# Altium project Wolf-Lite.PrjPcb (part 1 of 2)
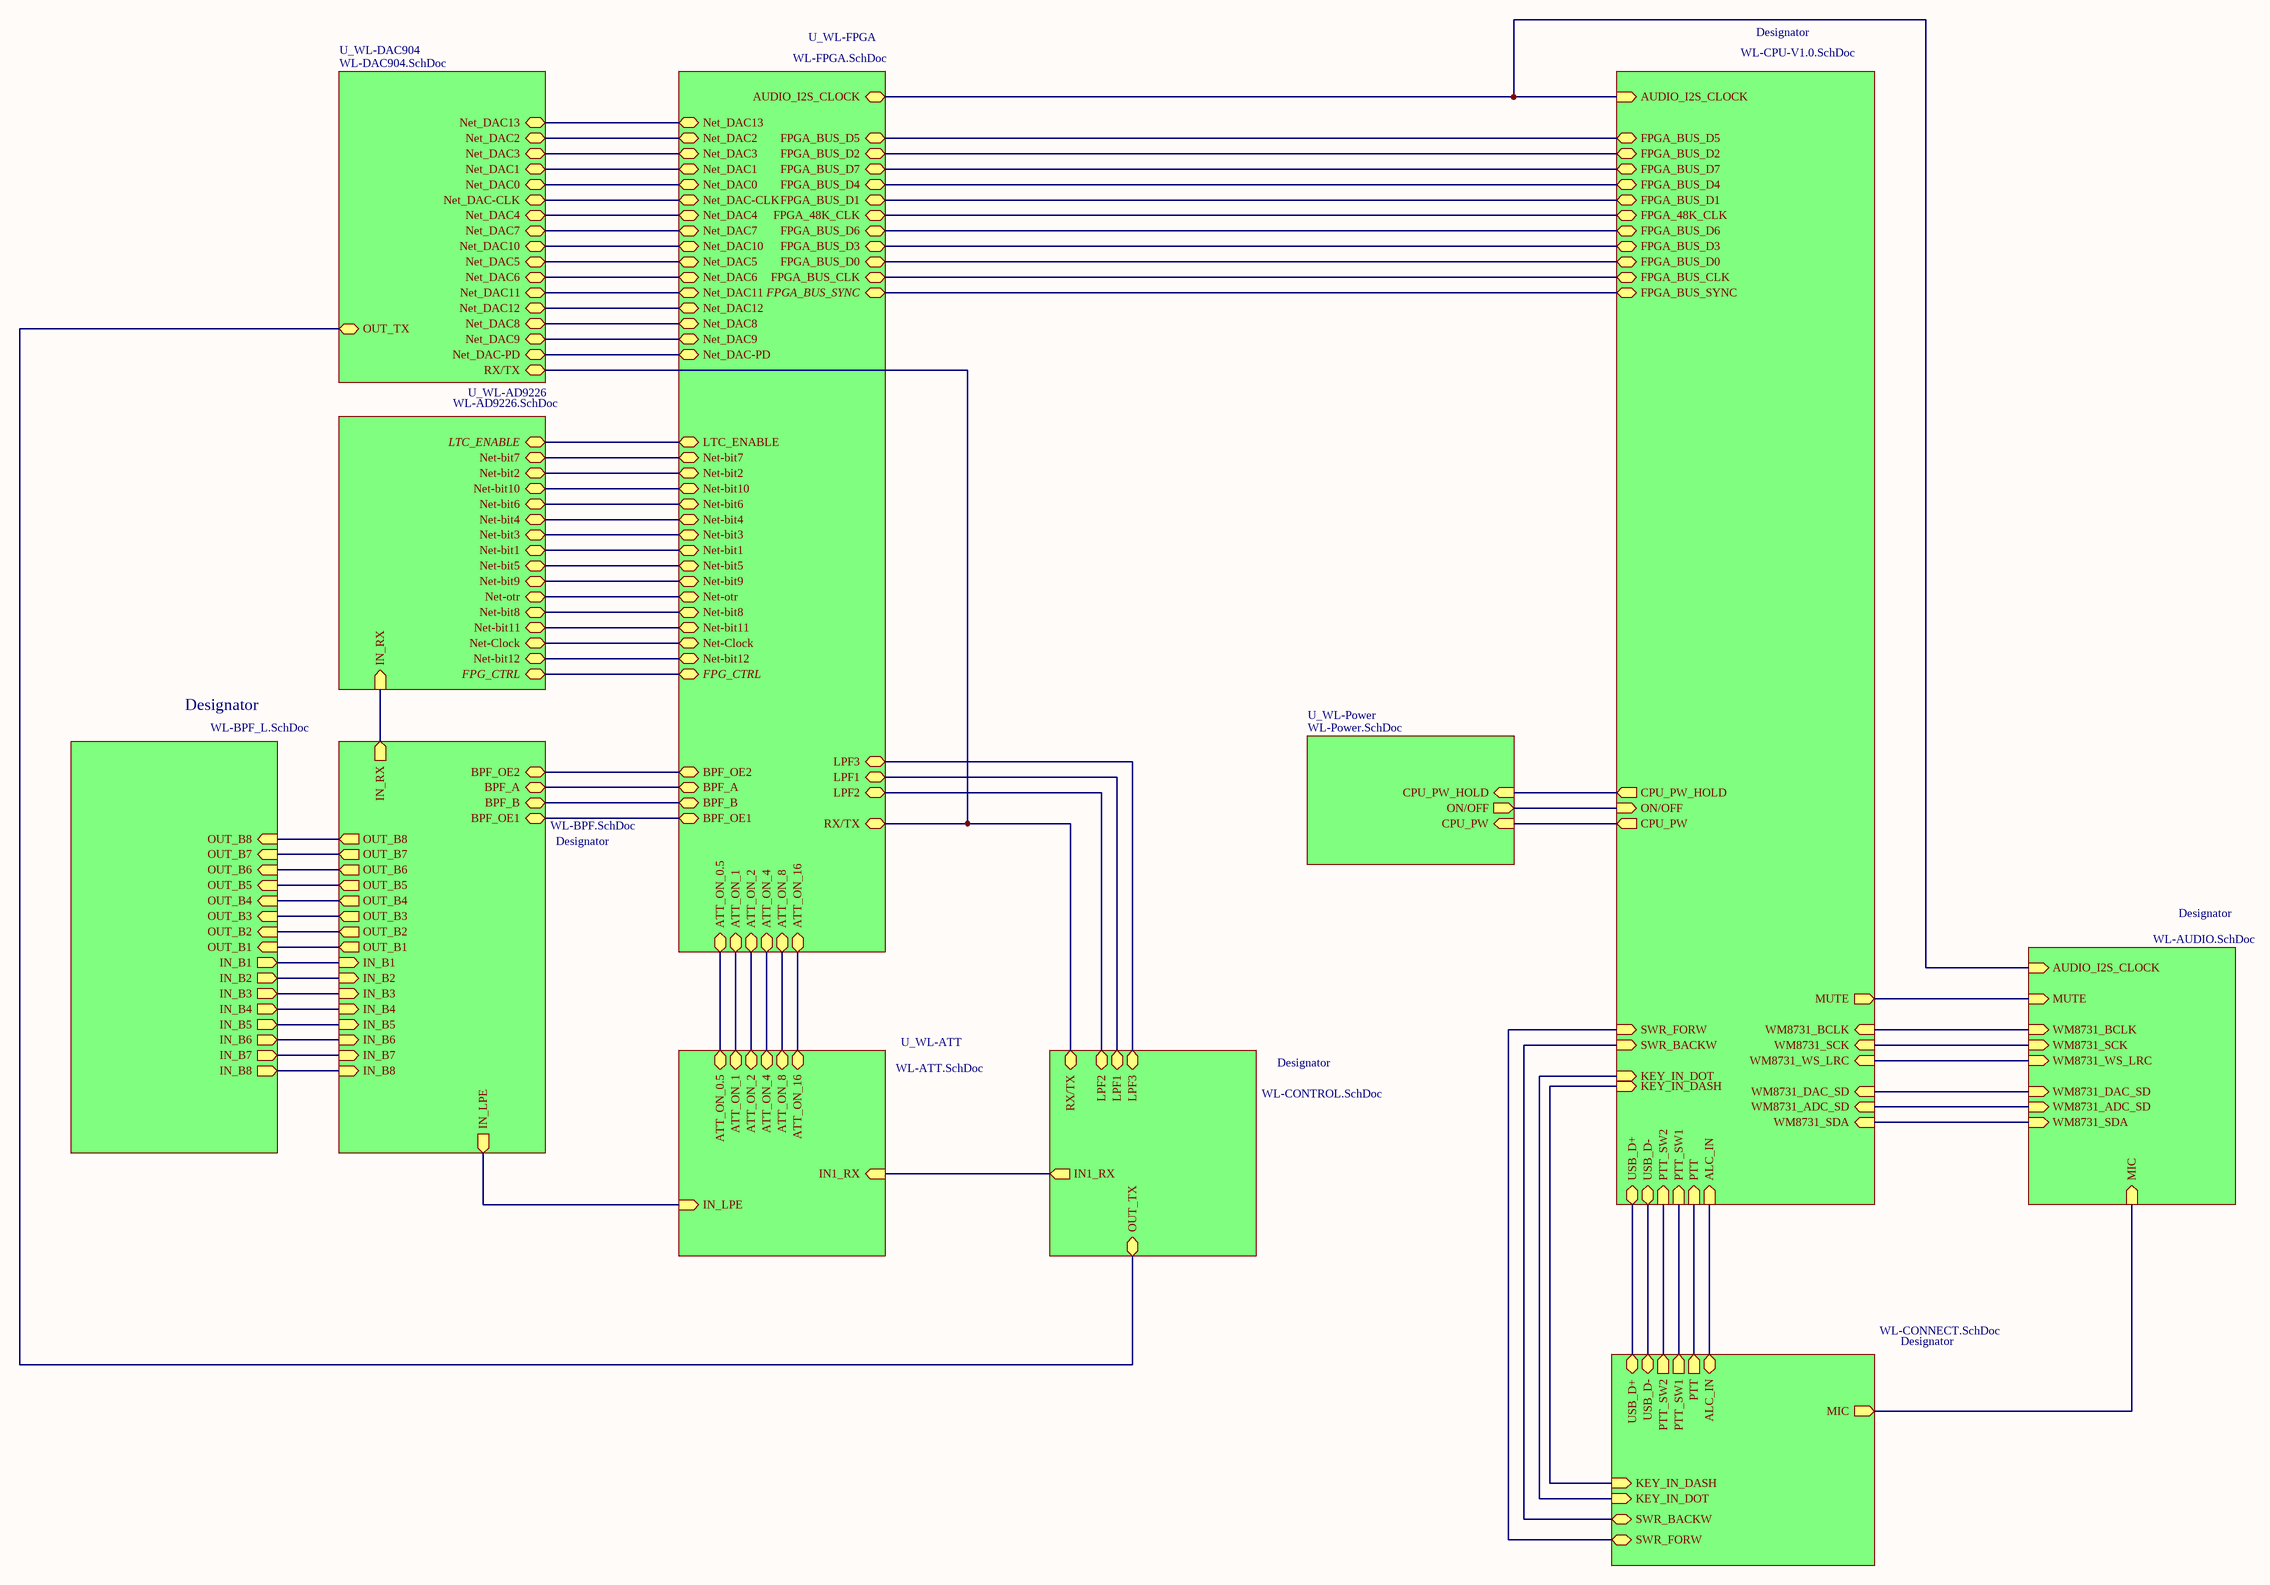
[diagram p0: WL-STUKTURNAY.SchDoc]
12 sheets, 403 parts. Net scope: hierarchical (ports join the sheet entries above them; power ports are global).
Board file: WL-MAIN.PcbDoc
Sheets:
  WL-STUKTURNAY.SchDoc
    U_WL-Power = WL-Power.SchDoc
    U_WL-AD9226 = WL-AD9226.SchDoc
    U_WL-FPGA = WL-FPGA.SchDoc
    U_WL-DAC904 = WL-DAC904.SchDoc
    U_WL-ATT = WL-ATT.SchDoc
    Designator = WL-CPU-V1.0.SchDoc
    Designator = WL-AUDIO.SchDoc
    Designator = WL-CONTROL.SchDoc
    Designator = WL-BPF.SchDoc
    Designator = WL-CONNECT.SchDoc
    Designator = WL-BPF_L.SchDoc

## Sheet WL-STUKTURNAY.SchDoc: WOLF-LITE
size 594 x 420 mm; Author: UA3REO/R7KBI; Address1: Address1; Address2: Address2; Address3: Address3; Address4: Address4; DocumentNumber: Wolf-Lite; SheetNumber: 1; SheetTotal: 12; Scale: 1:1; DocumentType: Схема электрическая принципиальная; FirstReferrence: АБВГ.123456.001

### Sub-sheets
Designator = WL-CPU-V1.0.SchDoc: MUTE (out), USB_D+ (bidir), USB_D- (bidir), PTT_SW2 (in), PTT_SW1 (in), PTT (in), FPGA_BUS_D5 (bidir), FPGA_BUS_D2 (bidir), FPGA_BUS_D7 (bidir), FPGA_BUS_D4 (bidir), FPGA_BUS_D1 (bidir), FPGA_48K_CLK (bidir), FPGA_BUS_D6 (bidir), FPGA_BUS_D3 (bidir), FPGA_BUS_D0 (bidir), FPGA_BUS_CLK (bidir), FPGA_BUS_SYNC (bidir), CPU_PW_HOLD (out), ON/OFF (in), CPU_PW (out), KEY_IN_DOT (in), KEY_IN_DASH (in), SWR_FORW (in), SWR_BACKW (in), ALC_IN (in), AUDIO_I2S_CLOCK (in), WM8731_SCK (in), WM8731_BCLK (in), WM8731_WS_LRC (in), WM8731_DAC_SD (in), WM8731_ADC_SD (in), WM8731_SDA (in)
Designator = WL-AUDIO.SchDoc: MUTE (in), MIC (in), WM8731_BCLK (in), WM8731_SCK (in), WM8731_WS_LRC (in), AUDIO_I2S_CLOCK (in), WM8731_DAC_SD (in), WM8731_ADC_SD (in), WM8731_SDA (in)
Designator = WL-CONTROL.SchDoc: OUT_TX (bidir), LPF2 (bidir), LPF1 (bidir), LPF3 (bidir), IN1_RX (out), RX/TX (bidir)
Designator = WL-BPF.SchDoc: IN_RX (out), BPF_OE2 (bidir), BPF_A (bidir), BPF_B (bidir), BPF_OE1 (bidir), OUT_B8 (out), OUT_B7 (out), OUT_B6 (out), OUT_B5 (out), OUT_B4 (out), OUT_B3 (out), OUT_B2 (out), OUT_B1 (out), IN_B1 (in), IN_B2 (in), IN_B3 (in), IN_B4 (in), IN_B5 (in), IN_B6 (in), IN_B7 (in), IN_B8 (in), IN_LPE (out)
Designator = WL-CONNECT.SchDoc: USB_D- (bidir), PTT (out), MIC (out), USB_D+ (bidir), PTT_SW2 (out), PTT_SW1 (out), ALC_IN (bidir), KEY_IN_DASH (in), KEY_IN_DOT (in), SWR_FORW (bidir), SWR_BACKW (bidir)
Designator = WL-BPF_L.SchDoc: OUT_B2 (in), OUT_B3 (in), OUT_B4 (in), OUT_B1 (in), IN_B1 (out), IN_B2 (out), IN_B3 (out), IN_B4 (out), OUT_B7 (in), OUT_B6 (in), OUT_B5 (in), IN_B7 (out), IN_B6 (out), IN_B5 (out), IN_B8 (out), OUT_B8 (in)
U_WL-AD9226 = WL-AD9226.SchDoc: Net-bit7 (bidir), Net-bit2 (bidir), Net-bit10 (bidir), Net-bit6 (bidir), Net-bit4 (bidir), Net-bit3 (bidir), Net-bit1 (bidir), Net-bit5 (bidir), Net-bit9 (bidir), Net-otr (bidir), Net-bit8 (bidir), Net-bit11 (bidir), Net-Clock (bidir), Net-bit12 (bidir), LTC_ENABLE (bidir), IN_RX (in), FPG_CTRL (bidir)
U_WL-ATT = WL-ATT.SchDoc: ATT_ON_1 (bidir), ATT_ON_2 (bidir), ATT_ON_16 (bidir), ATT_ON_8 (bidir), ATT_ON_4 (bidir), ATT_ON_0.5 (bidir), IN_LPE (in), IN1_RX (in)
U_WL-DAC904 = WL-DAC904.SchDoc: Net_DAC13 (bidir), Net_DAC2 (bidir), Net_DAC3 (bidir), Net_DAC1 (bidir), Net_DAC0 (bidir), Net_DAC-CLK (bidir), Net_DAC4 (bidir), Net_DAC7 (bidir), Net_DAC10 (bidir), Net_DAC5 (bidir), Net_DAC6 (bidir), Net_DAC11 (bidir), Net_DAC12 (bidir), Net_DAC8 (bidir), Net_DAC9 (bidir), OUT_TX (bidir), Net_DAC-PD (bidir), RX/TX (bidir)
U_WL-FPGA = WL-FPGA.SchDoc: FPGA_BUS_D5 (bidir), FPGA_BUS_D2 (bidir), FPGA_BUS_D7 (bidir), AUDIO_I2S_CLOCK (bidir), FPGA_BUS_D4 (bidir), FPGA_BUS_D1 (bidir), FPGA_48K_CLK (bidir), FPGA_BUS_D6 (bidir), FPGA_BUS_D3 (bidir), FPGA_BUS_D0 (bidir), FPGA_BUS_CLK (bidir), FPGA_BUS_SYNC (bidir), ATT_ON_0.5 (bidir), ATT_ON_1 (bidir), ATT_ON_2 (bidir), ATT_ON_4 (bidir), ATT_ON_8 (bidir), ATT_ON_16 (bidir), Net_DAC13 (bidir), Net_DAC2 (bidir), Net_DAC3 (bidir), Net_DAC1 (bidir), Net_DAC0 (bidir), Net_DAC-CLK (bidir), Net_DAC4 (bidir), Net_DAC7 (bidir), Net_DAC10 (bidir), Net_DAC5 (bidir), Net_DAC6 (bidir), Net_DAC11 (bidir), Net_DAC12 (bidir), Net_DAC8 (bidir), Net_DAC9 (bidir), Net-bit7 (bidir), Net-bit2 (bidir), Net-bit10 (bidir), Net-bit6 (bidir), Net-bit4 (bidir), Net-bit3 (bidir), Net-bit1 (bidir), Net-bit5 (bidir), Net-bit9 (bidir), Net-otr (bidir), Net-bit8 (bidir), Net-bit11 (bidir), Net-Clock (bidir), Net-bit12 (bidir), BPF_OE2 (bidir), BPF_A (bidir), BPF_B (bidir), BPF_OE1 (bidir), LPF2 (bidir), LPF1 (bidir), LPF3 (bidir), Net_DAC-PD (bidir), RX/TX (bidir), LTC_ENABLE (bidir), FPG_CTRL (bidir)
U_WL-Power = WL-Power.SchDoc: CPU_PW_HOLD (in), ON/OFF (out), CPU_PW (in)

### Nets
ALC_IN: sheet Designator/ALC_IN, sheet Designator/ALC_IN
ATT_ON_0.5: sheet U_WL-FPGA/ATT_ON_0.5, sheet U_WL-ATT/ATT_ON_0.5
ATT_ON_1: sheet U_WL-FPGA/ATT_ON_1, sheet U_WL-ATT/ATT_ON_1
ATT_ON_2: sheet U_WL-FPGA/ATT_ON_2, sheet U_WL-ATT/ATT_ON_2
ATT_ON_4: sheet U_WL-FPGA/ATT_ON_4, sheet U_WL-ATT/ATT_ON_4
ATT_ON_8: sheet U_WL-FPGA/ATT_ON_8, sheet U_WL-ATT/ATT_ON_8
ATT_ON_16: sheet U_WL-FPGA/ATT_ON_16, sheet U_WL-ATT/ATT_ON_16
AUDIO_I2S_CLOCK: sheet U_WL-FPGA/AUDIO_I2S_CLOCK, sheet Designator/AUDIO_I2S_CLOCK, sheet Designator/AUDIO_I2S_CLOCK
BPF_A: sheet U_WL-FPGA/BPF_A, sheet Designator/BPF_A
BPF_B: sheet U_WL-FPGA/BPF_B, sheet Designator/BPF_B
BPF_OE1: sheet U_WL-FPGA/BPF_OE1, sheet Designator/BPF_OE1
BPF_OE2: sheet U_WL-FPGA/BPF_OE2, sheet Designator/BPF_OE2
CPU_PW: sheet U_WL-Power/CPU_PW, sheet Designator/CPU_PW
CPU_PW_HOLD: sheet U_WL-Power/CPU_PW_HOLD, sheet Designator/CPU_PW_HOLD
FPG_CTRL: sheet U_WL-AD9226/FPG_CTRL, sheet U_WL-FPGA/FPG_CTRL
FPGA_48K_CLK: sheet U_WL-FPGA/FPGA_48K_CLK, sheet Designator/FPGA_48K_CLK
FPGA_BUS_CLK: sheet U_WL-FPGA/FPGA_BUS_CLK, sheet Designator/FPGA_BUS_CLK
FPGA_BUS_D0: sheet U_WL-FPGA/FPGA_BUS_D0, sheet Designator/FPGA_BUS_D0
FPGA_BUS_D1: sheet U_WL-FPGA/FPGA_BUS_D1, sheet Designator/FPGA_BUS_D1
FPGA_BUS_D2: sheet U_WL-FPGA/FPGA_BUS_D2, sheet Designator/FPGA_BUS_D2
FPGA_BUS_D3: sheet U_WL-FPGA/FPGA_BUS_D3, sheet Designator/FPGA_BUS_D3
FPGA_BUS_D4: sheet U_WL-FPGA/FPGA_BUS_D4, sheet Designator/FPGA_BUS_D4
FPGA_BUS_D5: sheet U_WL-FPGA/FPGA_BUS_D5, sheet Designator/FPGA_BUS_D5
FPGA_BUS_D6: sheet U_WL-FPGA/FPGA_BUS_D6, sheet Designator/FPGA_BUS_D6
FPGA_BUS_D7: sheet U_WL-FPGA/FPGA_BUS_D7, sheet Designator/FPGA_BUS_D7
FPGA_BUS_SYNC: sheet U_WL-FPGA/FPGA_BUS_SYNC, sheet Designator/FPGA_BUS_SYNC
IN_B1: sheet Designator/IN_B1, sheet Designator/IN_B1
IN_B2: sheet Designator/IN_B2, sheet Designator/IN_B2
IN_B3: sheet Designator/IN_B3, sheet Designator/IN_B3
IN_B4: sheet Designator/IN_B4, sheet Designator/IN_B4
IN_B5: sheet Designator/IN_B5, sheet Designator/IN_B5
IN_B6: sheet Designator/IN_B6, sheet Designator/IN_B6
IN_B7: sheet Designator/IN_B7, sheet Designator/IN_B7
IN_B8: sheet Designator/IN_B8, sheet Designator/IN_B8
IN_LPE: sheet U_WL-ATT/IN_LPE, sheet Designator/IN_LPE
IN_RX: sheet U_WL-AD9226/IN_RX, sheet Designator/IN_RX
KEY_IN_DASH: sheet Designator/KEY_IN_DASH, sheet Designator/KEY_IN_DASH
KEY_IN_DOT: sheet Designator/KEY_IN_DOT, sheet Designator/KEY_IN_DOT
LPF1: sheet U_WL-FPGA/LPF1, sheet Designator/LPF1
LPF2: sheet U_WL-FPGA/LPF2, sheet Designator/LPF2
LPF3: sheet U_WL-FPGA/LPF3, sheet Designator/LPF3
LTC_ENABLE: sheet U_WL-AD9226/LTC_ENABLE, sheet U_WL-FPGA/LTC_ENABLE
MIC: sheet Designator/MIC, sheet Designator/MIC
Net-bit1: sheet U_WL-AD9226/Net-bit1, sheet U_WL-FPGA/Net-bit1
Net-bit2: sheet U_WL-AD9226/Net-bit2, sheet U_WL-FPGA/Net-bit2
Net-bit3: sheet U_WL-AD9226/Net-bit3, sheet U_WL-FPGA/Net-bit3
Net-bit4: sheet U_WL-AD9226/Net-bit4, sheet U_WL-FPGA/Net-bit4
Net-bit5: sheet U_WL-AD9226/Net-bit5, sheet U_WL-FPGA/Net-bit5
Net-bit6: sheet U_WL-AD9226/Net-bit6, sheet U_WL-FPGA/Net-bit6
Net-bit7: sheet U_WL-AD9226/Net-bit7, sheet U_WL-FPGA/Net-bit7
Net-bit8: sheet U_WL-AD9226/Net-bit8, sheet U_WL-FPGA/Net-bit8
Net-bit9: sheet U_WL-AD9226/Net-bit9, sheet U_WL-FPGA/Net-bit9
Net-bit10: sheet U_WL-AD9226/Net-bit10, sheet U_WL-FPGA/Net-bit10
Net-bit11: sheet U_WL-AD9226/Net-bit11, sheet U_WL-FPGA/Net-bit11
Net-bit12: sheet U_WL-AD9226/Net-bit12, sheet U_WL-FPGA/Net-bit12
Net-Clock: sheet U_WL-AD9226/Net-Clock, sheet U_WL-FPGA/Net-Clock
Net-otr: sheet U_WL-AD9226/Net-otr, sheet U_WL-FPGA/Net-otr
Net_DAC0: sheet U_WL-FPGA/Net_DAC0, sheet U_WL-DAC904/Net_DAC0
Net_DAC1: sheet U_WL-FPGA/Net_DAC1, sheet U_WL-DAC904/Net_DAC1
Net_DAC2: sheet U_WL-FPGA/Net_DAC2, sheet U_WL-DAC904/Net_DAC2
Net_DAC3: sheet U_WL-FPGA/Net_DAC3, sheet U_WL-DAC904/Net_DAC3
Net_DAC4: sheet U_WL-FPGA/Net_DAC4, sheet U_WL-DAC904/Net_DAC4
Net_DAC5: sheet U_WL-FPGA/Net_DAC5, sheet U_WL-DAC904/Net_DAC5
Net_DAC6: sheet U_WL-FPGA/Net_DAC6, sheet U_WL-DAC904/Net_DAC6
Net_DAC7: sheet U_WL-FPGA/Net_DAC7, sheet U_WL-DAC904/Net_DAC7
Net_DAC8: sheet U_WL-FPGA/Net_DAC8, sheet U_WL-DAC904/Net_DAC8
Net_DAC9: sheet U_WL-FPGA/Net_DAC9, sheet U_WL-DAC904/Net_DAC9
Net_DAC10: sheet U_WL-FPGA/Net_DAC10, sheet U_WL-DAC904/Net_DAC10
Net_DAC11: sheet U_WL-FPGA/Net_DAC11, sheet U_WL-DAC904/Net_DAC11
Net_DAC12: sheet U_WL-FPGA/Net_DAC12, sheet U_WL-DAC904/Net_DAC12
Net_DAC13: sheet U_WL-FPGA/Net_DAC13, sheet U_WL-DAC904/Net_DAC13
Net_DAC-CLK: sheet U_WL-FPGA/Net_DAC-CLK, sheet U_WL-DAC904/Net_DAC-CLK
Net_DAC-PD: sheet U_WL-FPGA/Net_DAC-PD, sheet U_WL-DAC904/Net_DAC-PD
OUT_B1: sheet Designator/OUT_B1, sheet Designator/OUT_B1
OUT_B2: sheet Designator/OUT_B2, sheet Designator/OUT_B2
OUT_B3: sheet Designator/OUT_B3, sheet Designator/OUT_B3
OUT_B4: sheet Designator/OUT_B4, sheet Designator/OUT_B4
OUT_B5: sheet Designator/OUT_B5, sheet Designator/OUT_B5
OUT_B6: sheet Designator/OUT_B6, sheet Designator/OUT_B6
OUT_B7: sheet Designator/OUT_B7, sheet Designator/OUT_B7
OUT_B8: sheet Designator/OUT_B8, sheet Designator/OUT_B8
PTT: sheet Designator/PTT, sheet Designator/PTT
PTT_SW1: sheet Designator/PTT_SW1, sheet Designator/PTT_SW1
PTT_SW2: sheet Designator/PTT_SW2, sheet Designator/PTT_SW2
RX/TX: sheet U_WL-FPGA/RX/TX, sheet U_WL-DAC904/RX/TX, sheet Designator/RX/TX
SWR_BACKW: sheet Designator/SWR_BACKW, sheet Designator/SWR_BACKW
SWR_FORW: sheet Designator/SWR_FORW, sheet Designator/SWR_FORW
USB_D+: sheet Designator/USB_D+, sheet Designator/USB_D+
USB_D-: sheet Designator/USB_D-, sheet Designator/USB_D-
WM8731_ADC_SD: sheet Designator/WM8731_ADC_SD, sheet Designator/WM8731_ADC_SD
WM8731_BCLK: sheet Designator/WM8731_BCLK, sheet Designator/WM8731_BCLK
WM8731_DAC_SD: sheet Designator/WM8731_DAC_SD, sheet Designator/WM8731_DAC_SD
WM8731_SCK: sheet Designator/WM8731_SCK, sheet Designator/WM8731_SCK
WM8731_SDA: sheet Designator/WM8731_SDA, sheet Designator/WM8731_SDA
WM8731_WS_LRC: sheet Designator/WM8731_WS_LRC, sheet Designator/WM8731_WS_LRC
NetC76_1: sheet U_WL-ATT/IN1_RX, sheet Designator/IN1_RX
NetK1_4: sheet U_WL-DAC904/OUT_TX, sheet Designator/OUT_TX
NetR52_1: sheet U_WL-Power/ON/OFF, sheet Designator/ON/OFF
NetU1_64: sheet Designator/MUTE, sheet Designator/MUTE

### Notes on the sheet
- Перв. примен.
- Справ. №
- Подп. и дата
- Инв. № дубл.
- Взам. инв. №
- Разраб.
- Изм.
- Лист
- № докум.
- Подп.
- Дата
- Лит.
- Масса
- Масштаб
- Пров.
- Т.контр.
- Листов
- Инв. № подл.
- Утв.
- Н.контр.
- 2.106-A2
- Копировал
- Формат А2

## Sheet WL-Power.SchDoc
size 420 x 297 mm; Address1: Address1; Address2: Address2; Address3: Address3; Address4: Address4; DocumentNumber: Wolf-Lite; SheetNumber: 8; Scale: 1:1; DocumentType: Схема электрическая принципиальная; FirstReferrence: UA3REO/R7KBI
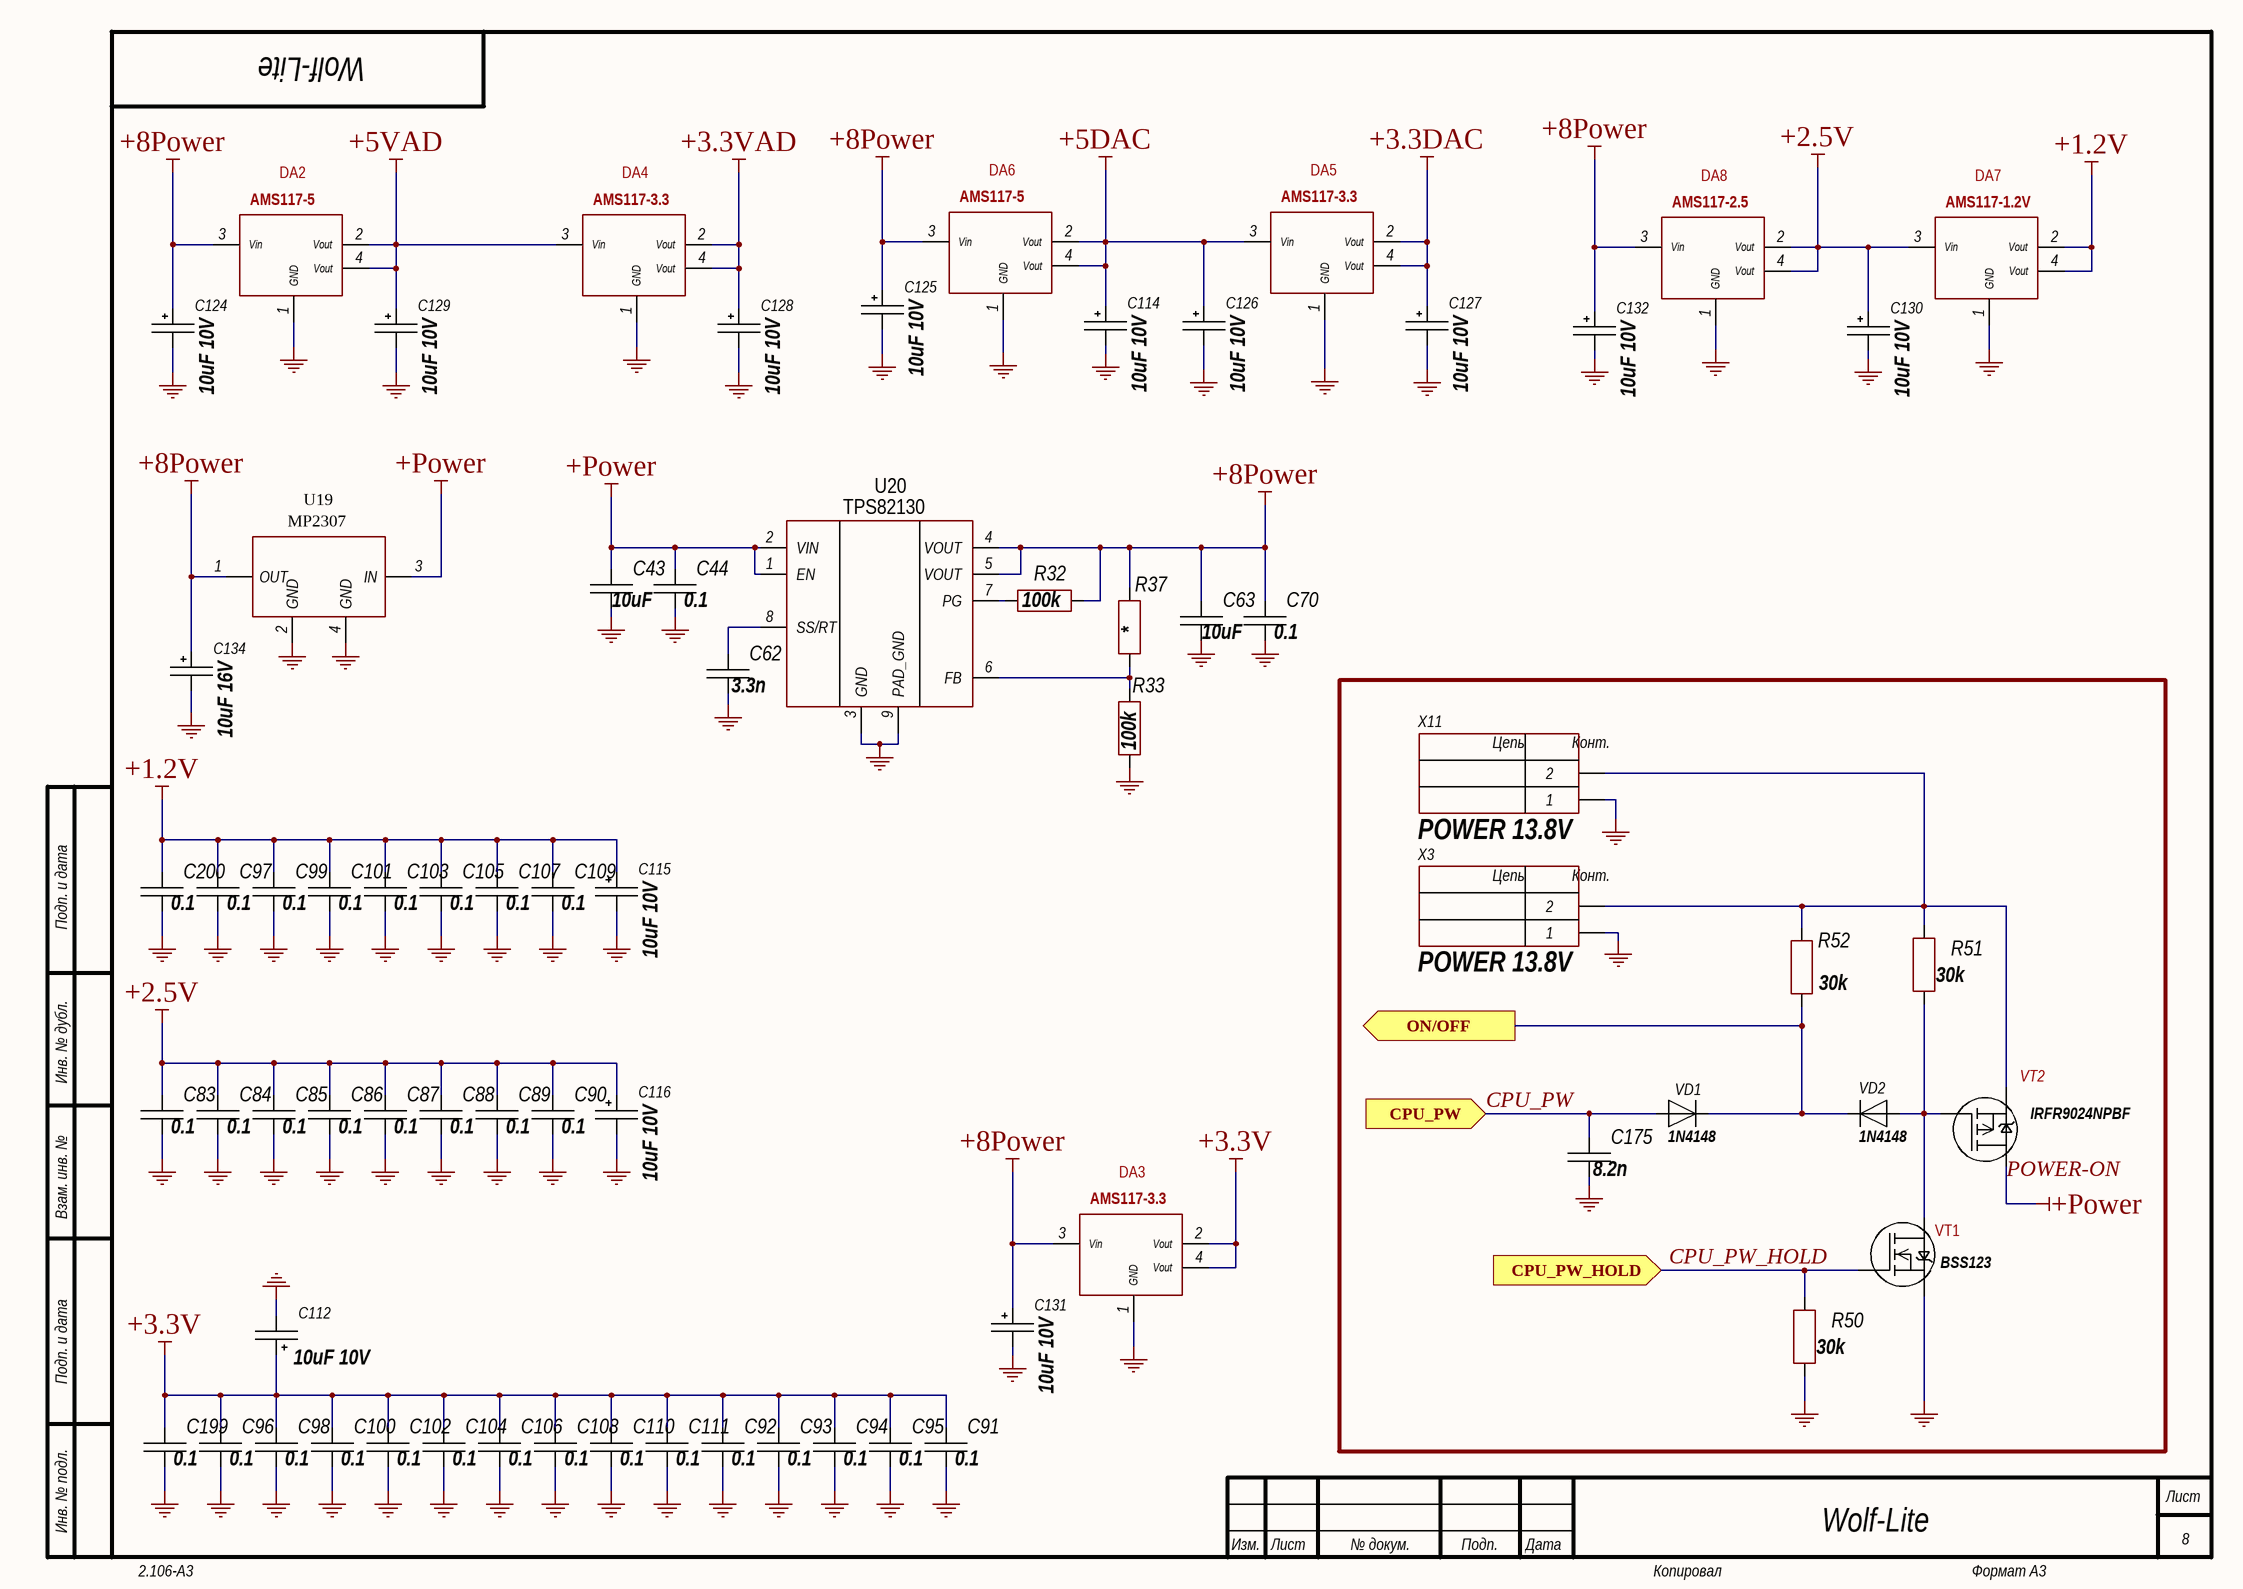
[diagram p1: WL-Power.SchDoc]

### Parts
C43  10uF  [CH1206C]
C44  0.1  [CH0805C]
C62  3.3n  [CH0805C]
C63  10uF  [CH1206C]
C70  0.1  [CH0805C]
C83  0.1  [CH0805C]
C84  0.1  [CH0805C]
C85  0.1  [CH0805C]
C86  0.1  [CH0805C]
C87  0.1  [CH0805C]
C88  0.1  [CH0805C]
C89  0.1  [CH0805C]
C90  0.1  [CH0805C]
C91  0.1  [CH0805C]
C92  0.1  [CH0805C]
C93  0.1  [CH0805C]
C94  0.1  [CH0805C]
C95  0.1  [CH0805C]
C96  0.1  [CH0805C]
C97  0.1  [CH0805C]
C98  0.1  [CH0805C]
C99  0.1  [CH0805C]
C100  0.1  [CH0805C]
C101  0.1  [CH0805C]
C102  0.1  [CH0805C]
C103  0.1  [CH0805C]
C104  0.1  [CH0805C]
C105  0.1  [CH0805C]
C106  0.1  [CH0805C]
C107  0.1  [CH0805C]
C108  0.1  [CH0805C]
C109  0.1  [CH0805C]
C110  0.1  [CH0805C]
C111  0.1  [CH0805C]
C112  10uF 10V  [TANTAL_B]
C114  10uF 10V  [TANTAL_B]
C115  10uF 10V  [TANTAL_B]
C116  10uF 10V  [TANTAL_B]
C124  10uF 10V  [TANTAL_B]
C125  10uF 10V  [TANTAL_B]
C126  10uF 10V  [TANTAL_B]
C127  10uF 10V  [TANTAL_B]
C128  10uF 10V  [TANTAL_B]
C129  10uF 10V  [TANTAL_B]
C130  10uF 10V  [TANTAL_B]
C131  10uF 10V  [TANTAL_B]
C132  10uF 10V  [TANTAL_B]
C134  10uF 16V  [POLIMER-D]
C175  8.2n  [CH0805C]
C199  0.1  [CH0805C]
C200  0.1  [CH0805C]
DA2  AMS117-5  [SOT223]
DA3  AMS117-3.3  [SOT223]
DA4  AMS117-3.3  [SOT223]
DA5  AMS117-3.3  [SOT223]
DA6  AMS117-5  [SOT223]
DA7  AMS117-1.2V  [SOT223]
DA8  AMS117-2.5  [SOT223]
R32  100k  [CH0805R]
R33  100k  [CH0805R]
R37  *  [CH0805R]
R50  30k  [CH0805R]
R51  30k  [CH0805R]
R52  30k  [CH0805R]
U19  MP2307  [MP2307 MINI360]
U20  TPS82130  [TPS82130SILT]
VD1  1N4148  [1N4148]
VD2  1N4148  [1N4148]
VT1  BSS123  [SOT23_132]
VT2  IRFR9024NPBF  [D2PAK_132]
X3  POWER 13.8V  [CON: 300-02P-5.0]
X11  POWER 13.8V  [CON: 300-02P-5.0]

### Ports
CPU_PW (in), CPU_PW_HOLD (in), ON/OFF (out)

### Nets
+1.2V: C97.1 C99.1 C101.1 C103.1 C105.1 C107.1 C109.1 C115.1 C200.1 DA7.2(Vout) DA7.4(Vout)
+2.5V: C83.1 C84.1 C85.1 C86.1 C87.1 C88.1 C89.1 C90.1 C116.1 C130.1 DA7.3(Vin) DA8.2(Vout) DA8.4(Vout)
+3.3DAC: C127.1 DA5.2(Vout) DA5.4(Vout)
+3.3V: C91.1 C92.1 C93.1 C94.1 C95.1 C96.1 C98.1 C100.1 C102.1 C104.1 C106.1 C108.1 C110.1 C111.1 C112.1 C199.1 DA3.2(Vout) DA3.4(Vout)
+3.3VAD: C128.1 DA4.2(Vout) DA4.4(Vout)
+5DAC: C114.1 C126.1 DA5.3(Vin) DA6.2(Vout) DA6.4(Vout)
+5VAD: C129.1 DA2.2(Vout) DA2.4(Vout) DA4.3(Vin)
+8Power: C63.1 C70.1 C124.1 C125.1 C131.1 C132.1 C134.1 DA2.3(Vin) DA3.3(Vin) DA6.3(Vin) DA8.3(Vin) R32.1 R37.1 U19.1(OUT) U20.4(VOUT) U20.5(VOUT)
GND: C43.2 C44.2 C62.2 C63.2 C70.2 C83.2 C84.2 C85.2 C86.2 C87.2 C88.2 C89.2 C90.2 C91.2 C92.2 C93.2 C94.2 C95.2 C96.2 C97.2 C98.2 C99.2 C100.2 C101.2 C102.2 C103.2 C104.2 C105.2 C106.2 C107.2 C108.2 C109.2 C110.2 C111.2 C112.2 C114.2 C115.2 C116.2 C124.2 C125.2 C126.2 C127.2 C128.2 C129.2 C130.2 C131.2 C132.2 C134.2 C175.2 C199.2 C200.2 DA2.1(GND) DA3.1(GND) DA4.1(GND) DA5.1(GND) DA6.1(GND) DA7.1(GND) DA8.1(GND) R33.2 R50.1 U19.2(GND) U19.4(GND) U20.3(GND) U20.9(PAD_GND) VT1.2(I) X3.1 X11.1
POWER-ON: C43.1 C44.1 U19.3(IN) U20.1(EN) U20.2(VIN) VT2.3(D)  [also labelled +Power]
CPU_PW: C175.1 VD1.1 ; port CPU_PW
CPU_PW_HOLD: R50.2 VT1.1(Затвор(Gate)) ; port CPU_PW_HOLD
NetC62_1: C62.1 U20.8(SS/RT)
NetR32_2: R32.2 U20.7(PG)
NetR33_1: R33.1 R37.2 U20.6(FB)
NetR51_1: R51.1 VD2.1 VT1.3(Сток(Drain)) VT2.1(Затвор(Gate))
NetR51_2: R51.2 R52.2 VT2.2(S) X3.2 X11.2
NetR52_1: R52.1 VD1.2 VD2.2 ; port ON/OFF

### Notes on the sheet
- Подп. и дата
- Инв. № дубл.
- Взам. инв. №
- Инв. № подл.
- Изм.
- Лист
- № докум.
- Подп.
- Дата
- 2.106-A3
- Копировал
- Формат А3
- (in symbol 2-Connector) Цепь; Конт.

### Library data of the parts
C43 C44 C62 C63 C70 C83-C111 C175 C199 C200 = Capacitor: Manufacturer: *; Model: *; HelpURL: *; ComponentKind: *; Value: *
C112 C114-C116 C124-C132 C134 = TantalCap: Manufacturer: *; Model: *; HelpURL: *; ComponentKind: *; Value: *
DA2-DA8 = AMS117
R32 R33 R37 R50-R52 = Resistor: Manufacturer: *; Model: *; HelpURL: *; ComponentKind: *; Value: *
VD1 VD2 = Diod: ComponentKind: *; Manufacturer: *; Model: *; HelpURL: *
VT1 = N-KANAL
VT2 = P-KANAL
X3 X11 = 2-Connector: Model: *; Manufacturer: *; HelpURL: *; ComponentKind: *

## Sheet WL-AD9226.SchDoc
size 594 x 420 mm; Address1: Address1; Address2: Address2; Address3: Address3; Address4: Address4; DocumentNumber: Wolf-Lite; SheetNumber: 4; Scale: 1:1; DocumentType: Схема электрическая принципиальная; FirstReferrence: UA3REO/R7KBI
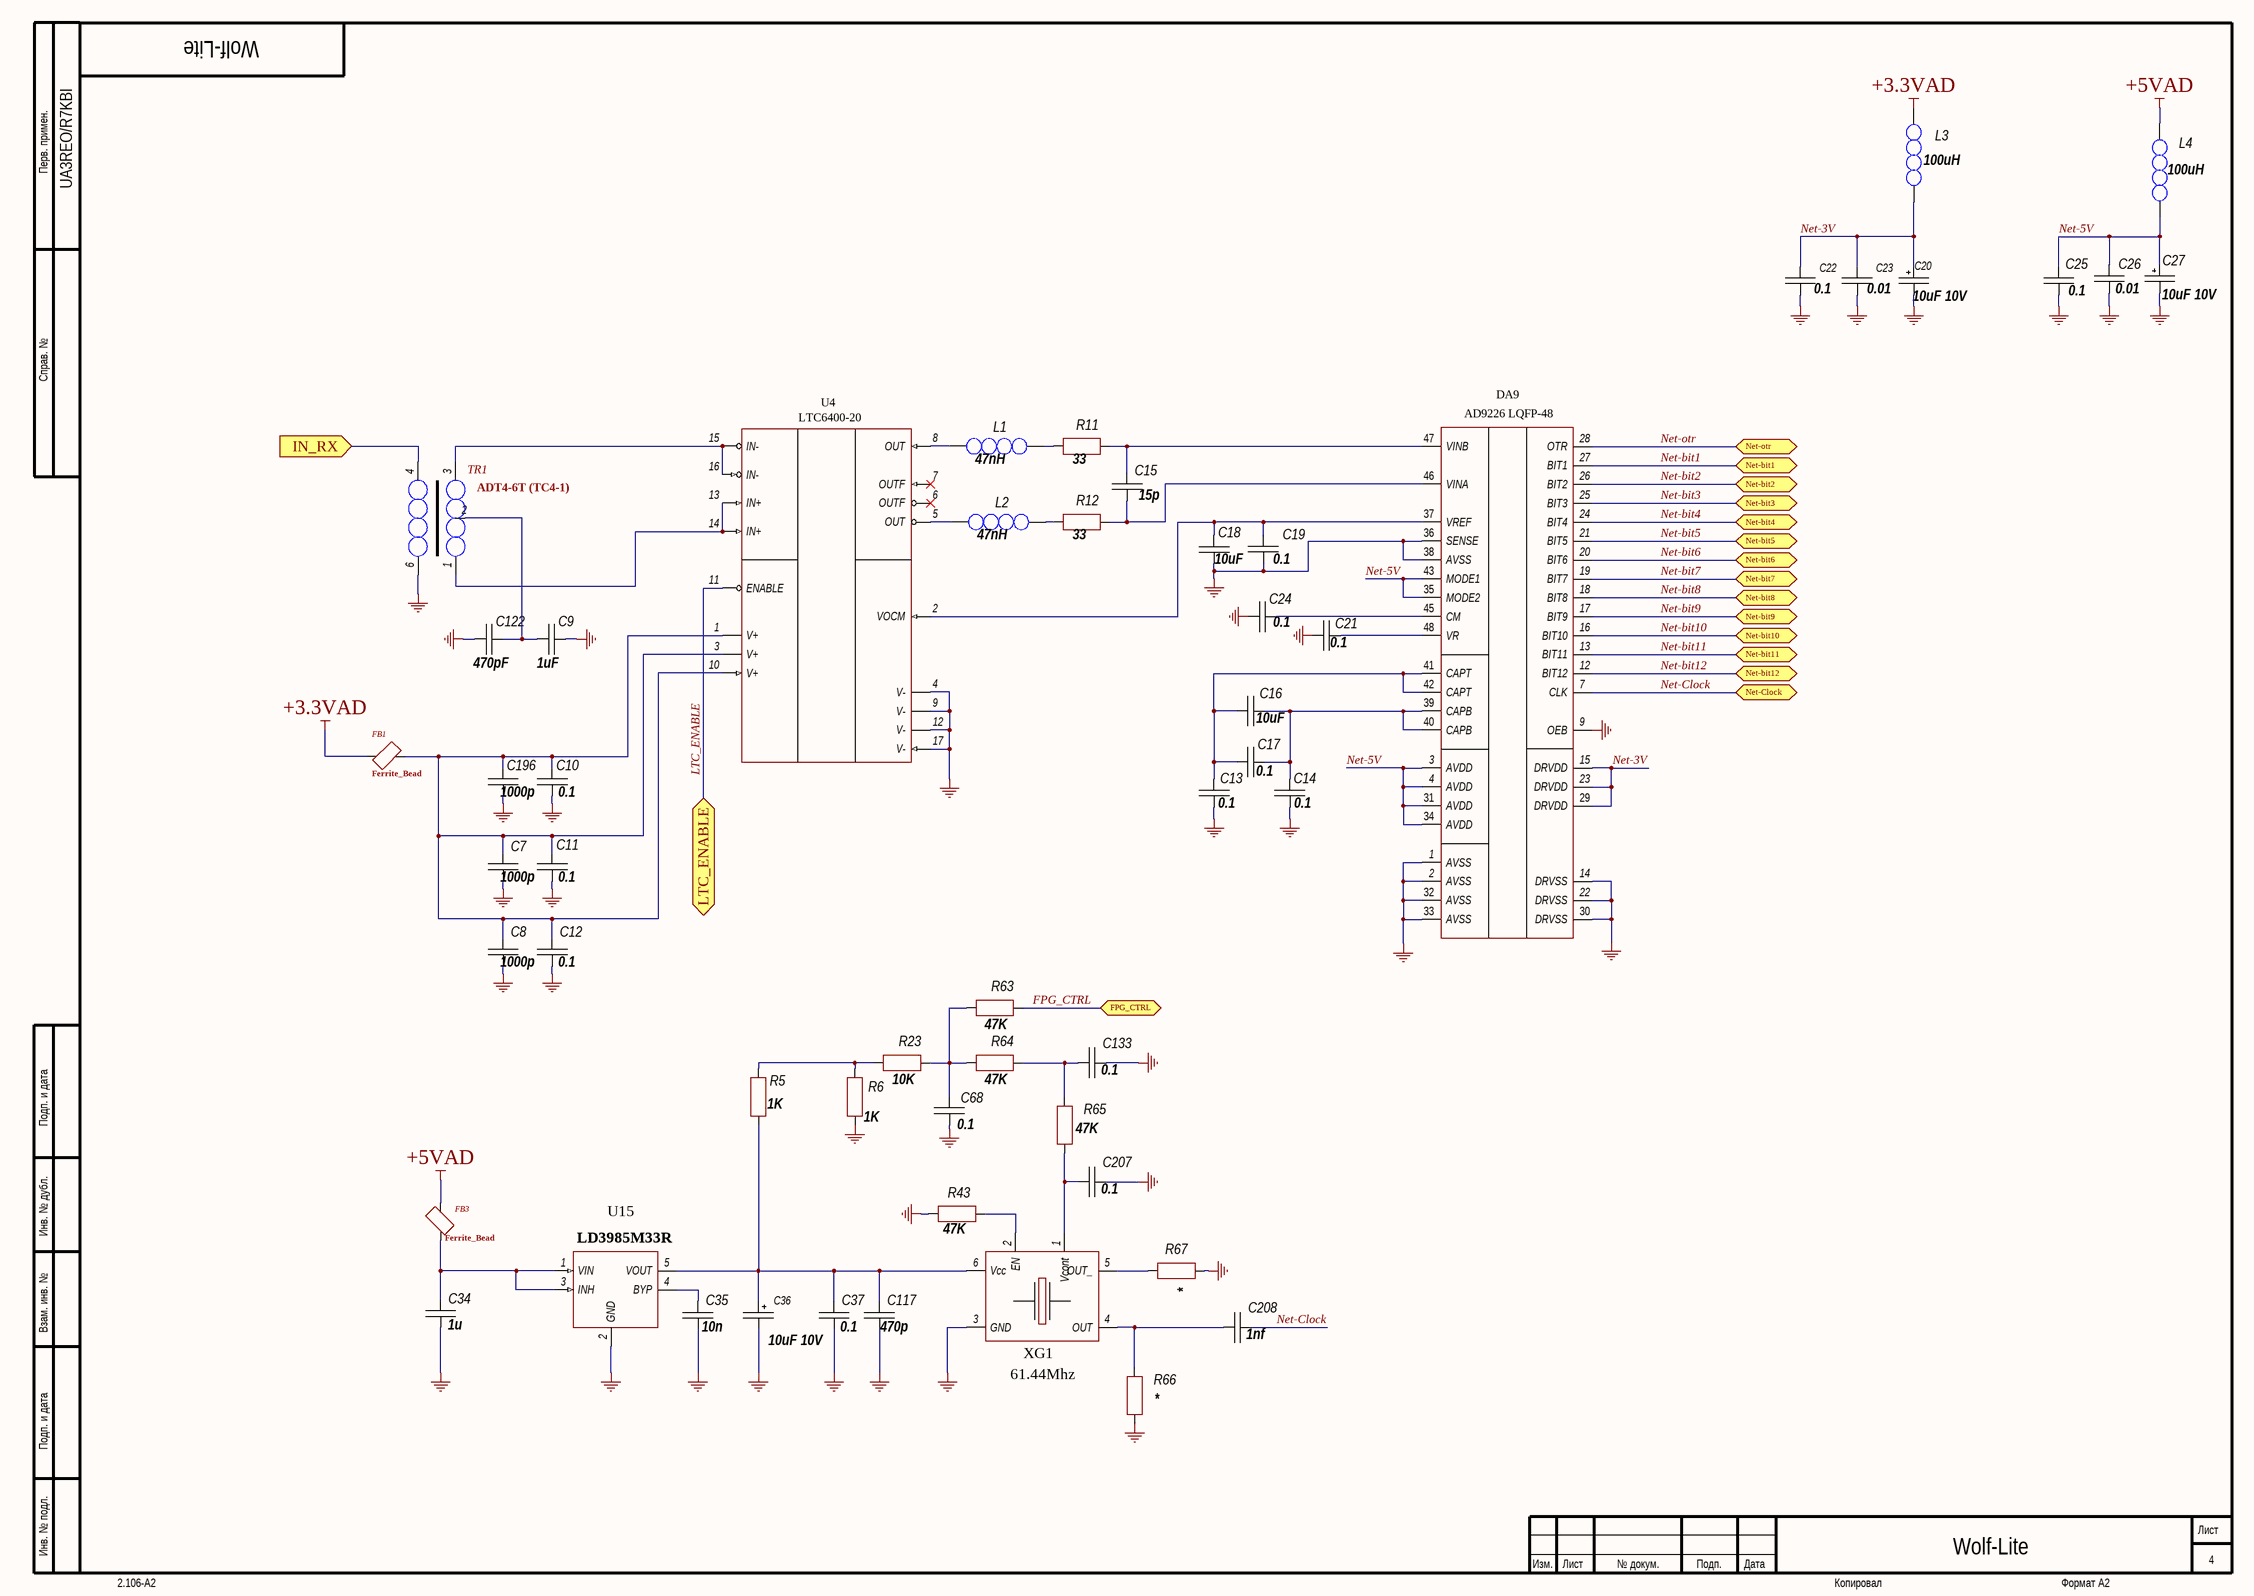
[diagram p2: WL-AD9226.SchDoc]

### Parts
C7  1000p  [CH0805C]
C8  1000p  [CH0805C]
C9  1uF  [CH0805C]
C10  0.1  [CH0805C]
C11  0.1  [CH0805C]
C12  0.1  [CH0805C]
C13  0.1  [CH0805C]
C14  0.1  [CH0805C]
C15  15p  [CH0805C]
C16  10uF  [CH0805C]
C17  0.1  [CH0805C]
C18  10uF  [CH0805C]
C19  0.1  [CH0805C]
C20  10uF 10V  [TANTAL_A]
C21  0.1  [CH0805C]
C22  0.1  [CH0805C]
C23  0.01  [CH0805C]
C24  0.1  [CH0805C]
C25  0.1  [CH0805C]
C26  0.01  [CH0805C]
C27  10uF 10V  [TANTAL_A]
C34  1u  [CH0805C]
C35  10n  [CH0805C]
C36  10uF 10V  [TANTAL_A]
C37  0.1  [CH0805C]
C68  0.1  [CH0805C]
C117  470p  [CH0805C]
C122  470pF  [CH0805C]
C133  0.1  [CH0805C]
C196  1000p  [CH0805C]
C207  0.1  [CH0805C]
C208  1nf  [CH0805C]
DA9  AD9226 LQFP-48  [48-LQFP]
FB1  Ferrite_Bead  [CH0805L]
FB3  Ferrite_Bead  [CH0805L]
L1  47nH  [L1210]
L2  47nH  [L1210]
L3  100uH  [CH0805L]
L4  100uH  [CH0805L]
R5  1K  [CH0805R]
R6  1K  [CH0805R]
R11  33  [CH0805R]
R12  33  [CH0805R]
R23  10K  [CH0805R]
R43  47K  [CH0805R]
R63  47K  [CH0805R]
R64  47K  [CH0805R]
R65  47K  [CH0805R]
R66  *  [CH0805R]
R67  *  [CH0805R]
TR1  ADT4-6T (TC4-1)  [TC1-4]
U4  LTC6400-20  [16-QFN (3x3)]
U15  LD3985M33R  [SOT23-5]
XG1  61.44Mhz  [OCS: GENA]

### Ports
FPG_CTRL (bidir), IN_RX (in), LTC_ENABLE (bidir), Net-bit1 (bidir), Net-bit2 (bidir), Net-bit3 (bidir), Net-bit4 (bidir), Net-bit5 (bidir), Net-bit6 (bidir), Net-bit7 (bidir), Net-bit8 (bidir), Net-bit9 (bidir), Net-bit10 (bidir), Net-bit11 (bidir), Net-bit12 (bidir), Net-Clock (bidir), Net-otr (bidir)

### Nets
+3.3VAD: FB1.1 L3.2
+5VAD: FB3.2 L4.2
GND: C7.1 C8.1 C9.1 C10.1 C11.1 C12.1 C13.1 C14.1 C18.2 C19.1 C20.2 C21.1 C22.1 C23.1 C24.2 C25.1 C26.1 C27.2 C34.2 C35.2 C36.2 C37.2 C68.1 C117.2 C122.2 C133.2 C196.1 C207.2 DA9.1(AVSS) DA9.2(AVSS) DA9.9(OEB) DA9.14(DRVSS) DA9.22(DRVSS) DA9.30(DRVSS) DA9.32(AVSS) DA9.33(AVSS) DA9.36(SENSE) DA9.38(AVSS) R6.2 R43.2 R66.1 R67.1 TR1.6 U4.4(V-) U4.9(V-) U4.12(V-) U4.17(V-) U15.2(GND) XG1.3(GND)
FPG_CTRL: R63.1 ; port FPG_CTRL
IN_RX: TR1.4 ; port IN_RX
LTC_ENABLE: U4.11(ENABLE) ; port LTC_ENABLE
Net-3V: C20.1 C22.2 C23.2 DA9.15(DRVDD) DA9.23(DRVDD) DA9.29(DRVDD) L3.1
Net-5V: C25.2 C26.2 C27.1 DA9.3(AVDD) DA9.4(AVDD) DA9.31(AVDD) DA9.34(AVDD) DA9.35(MODE2) DA9.43(MODE1) L4.1
Net-bit1: DA9.27(BIT1) ; port Net-bit1
Net-bit2: DA9.26(BIT2) ; port Net-bit2
Net-bit3: DA9.25(BIT3) ; port Net-bit3
Net-bit4: DA9.24(BIT4) ; port Net-bit4
Net-bit5: DA9.21(BIT5) ; port Net-bit5
Net-bit6: DA9.20(BIT6) ; port Net-bit6
Net-bit7: DA9.19(BIT7) ; port Net-bit7
Net-bit8: DA9.18(BIT8) ; port Net-bit8
Net-bit9: DA9.17(BIT9) ; port Net-bit9
Net-bit10: DA9.16(BIT10) ; port Net-bit10
Net-bit11: DA9.13(BIT11) ; port Net-bit11
Net-bit12: DA9.12(BIT12) ; port Net-bit12
Net-Clock: C208.2 DA9.7(CLK) ; port Net-Clock
Net-otr: DA9.28(OTR) ; port Net-otr
NetC7_2: C7.2 C8.2 C10.2 C11.2 C12.2 C196.2 FB1.2 U4.1(V+) U4.3(V+) U4.10(V+)
NetC9_2: C9.2 C122.1 TR1.2
NetC13_2: C13.2 C16.1 C17.1 DA9.41(CAPT) DA9.42(CAPT)
NetC14_2: C14.2 C16.2 C17.2 DA9.39(CAPB) DA9.40(CAPB)
NetC15_1: C15.1 DA9.46(VINA) R12.2
NetC15_2: C15.2 DA9.47(VINB) R11.2
NetC18_1: C18.1 C19.2 DA9.37(VREF) U4.2(VOCM)
NetC21_2: C21.2 DA9.48(VR)
NetC24_1: C24.1 DA9.45(CM)
NetC34_1: C34.1 FB3.1 U15.1(VIN) U15.3(INH)
NetC35_1: C35.1 U15.4(BYP)
NetC36_1: C36.1 C37.1 C117.1 R5.1 U15.5(VOUT) XG1.6(Vcc)
NetC68_2: C68.2 R23.1 R63.2 R64.2
NetC133_1: C133.1 R64.1 R65.2
NetC207_1: C207.1 R65.1 XG1.1(Vcont)
NetC208_1: C208.1 R66.2 XG1.4(OUT)
NetL1_1: L1.1 R11.1
NetL1_2: L1.2 U4.8(OUT)
NetL2_1: L2.1 R12.1
NetL2_2: L2.2 U4.5(OUT)
NetR5_2: R5.2 R6.1 R23.2
NetR43_1: R43.1 XG1.2(EN)
NetR67_2: R67.2 XG1.5(OUT_)
NetTR1_1: TR1.1 U4.13(IN+) U4.14(IN+)
NetTR1_3: TR1.3 U4.15(IN-) U4.16(IN-)

Not connected (* = marked no-connect by the designer): U4 6(OUTF)* 7(OUTF)*

### Notes on the sheet
- Перв. примен.
- Справ. №
- Подп. и дата
- Инв. № дубл.
- Взам. инв. №
- Инв. № подл.
- Изм.
- Лист
- № докум.
- Подп.
- Дата
- 2.106-A2
- Копировал
- Формат А2

### Library data of the parts
C7-C19 C21-C26 C34 C35 C37 C68 C117 C122 C133 C196 C207 C208 = Capacitor: Manufacturer: *; Model: *; HelpURL: *; ComponentKind: *; Value: *
C20 C27 C36 = TantalCap: Manufacturer: *; Model: *; HelpURL: *; ComponentKind: *; Value: *
DA9 = AD9226 LQFP
FB1 FB3 = FB
L1-L4 = Inductor: Manufacturer: *; Model: *; HelpURL: *; ComponentKind: *; Value: *
R5 R6 R11 R12 R23 R43 R63-R67 = Resistor: Manufacturer: *; Model: *; HelpURL: *; ComponentKind: *; Value: *
TR1 = TC4-1
U4 = LTC6400-1
U15 = LD3985M33R_SOT23
XG1 = Generator

## Sheet WL-FPGA.SchDoc
size 594 x 420 mm; Address1: Address1; Address2: Address2; Address3: Address3; Address4: Address4; DocumentNumber: Wolf-Lite; SheetNumber: 3; Scale: 1:1; DocumentType: Схема электрическая принципиальная; FirstReferrence: UA3REO/R7KBI
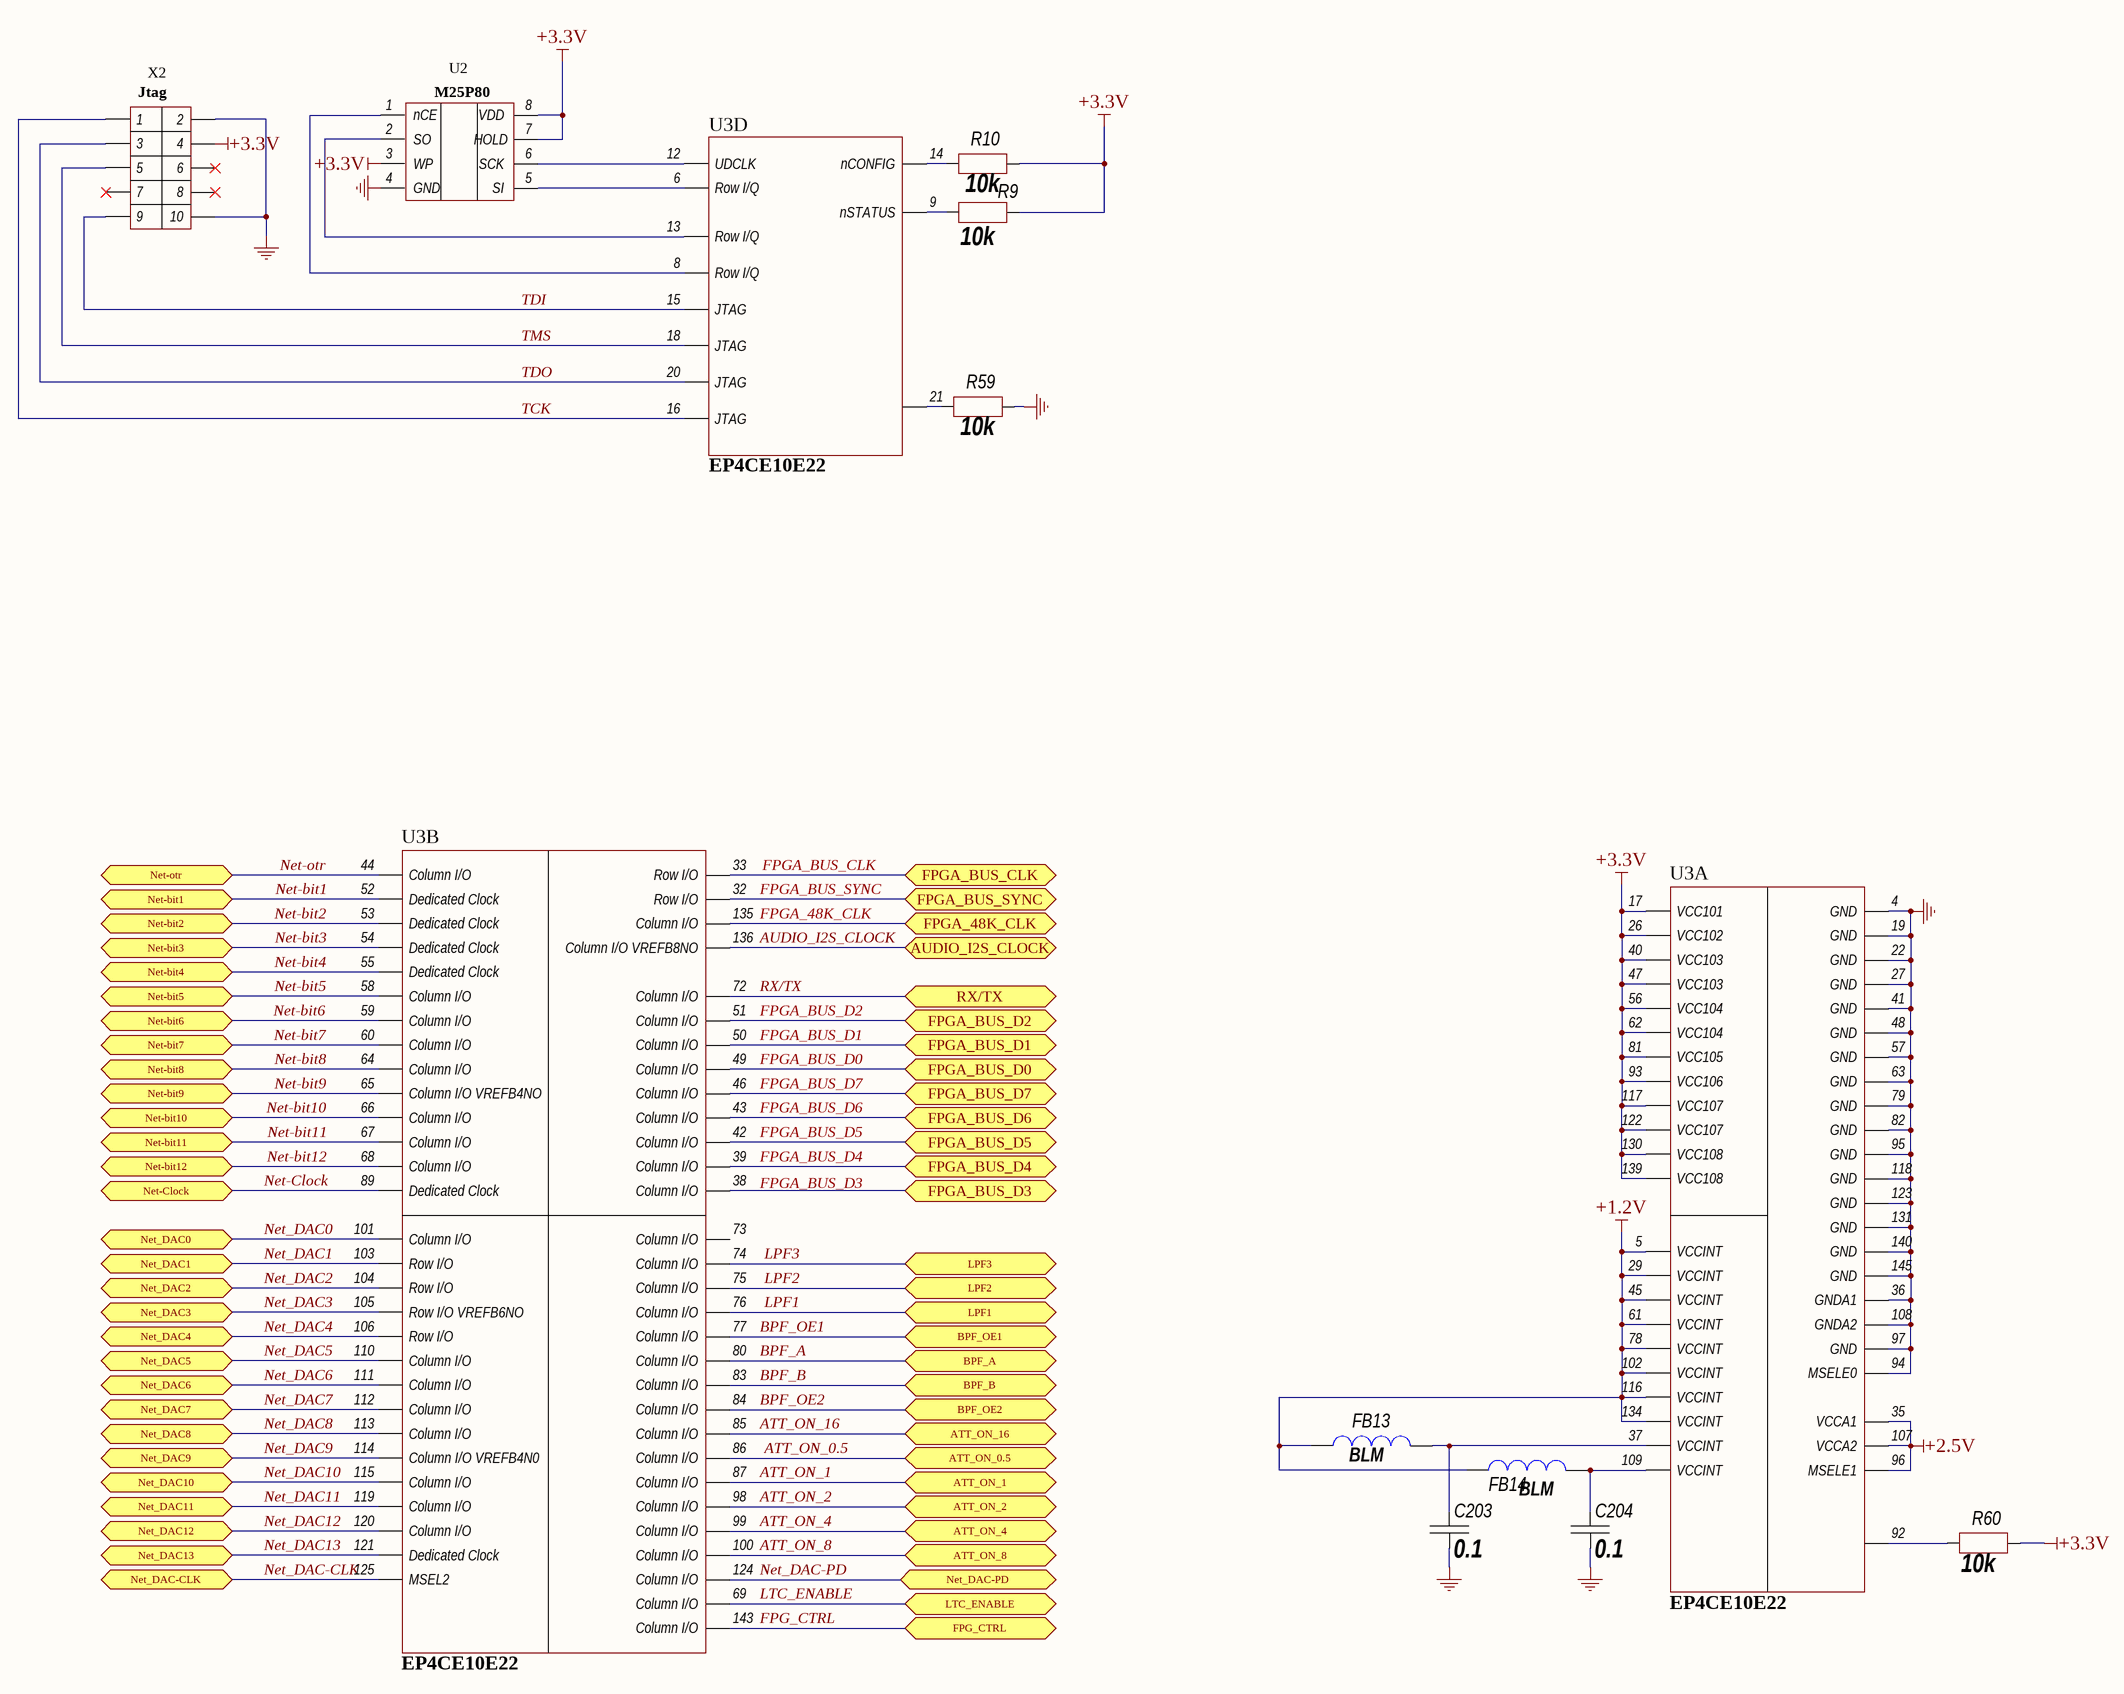
[diagram p3: WL-FPGA.SchDoc]

### Parts
C203  0.1  [CH0805C]
C204  0.1  [CH0805C]
FB13  BLM  [CH0805L]
FB14  BLM  [CH0805L]
R9  10k  [CH0805R]
R10  10k  [CH0805R]
R59  10k  [CH0805R]
R60  10k  [CH0805R]
U2  M25P80  [SOIC-8-1]
U3  EP4CE10E22  [144-QFN]  (parts A,B,D of 4)
X2  Jtag  [CON: BH-10]

### Ports
ATT_ON_0.5 (bidir), ATT_ON_1 (bidir), ATT_ON_2 (bidir), ATT_ON_4 (bidir), ATT_ON_8 (bidir), ATT_ON_16 (bidir), AUDIO_I2S_CLOCK (bidir), BPF_A (bidir), BPF_B (bidir), BPF_OE1 (bidir), BPF_OE2 (bidir), FPG_CTRL (bidir), FPGA_48K_CLK (bidir), FPGA_BUS_CLK (bidir), FPGA_BUS_D0 (bidir), FPGA_BUS_D1 (bidir), FPGA_BUS_D2 (bidir), FPGA_BUS_D3 (bidir), FPGA_BUS_D4 (bidir), FPGA_BUS_D5 (bidir), FPGA_BUS_D6 (bidir), FPGA_BUS_D7 (bidir), FPGA_BUS_SYNC (bidir), LPF1 (bidir), LPF2 (bidir), LPF3 (bidir), LTC_ENABLE (bidir), Net-bit1 (bidir), Net-bit2 (bidir), Net-bit3 (bidir), Net-bit4 (bidir), Net-bit5 (bidir), Net-bit6 (bidir), Net-bit7 (bidir), Net-bit8 (bidir), Net-bit9 (bidir), Net-bit10 (bidir), Net-bit11 (bidir), Net-bit12 (bidir), Net-Clock (bidir), Net-otr (bidir), Net_DAC0 (bidir), Net_DAC1 (bidir), Net_DAC2 (bidir), Net_DAC3 (bidir), Net_DAC4 (bidir), Net_DAC5 (bidir), Net_DAC6 (bidir), Net_DAC7 (bidir), Net_DAC8 (bidir), Net_DAC9 (bidir), Net_DAC10 (bidir), Net_DAC11 (bidir), Net_DAC12 (bidir), Net_DAC13 (bidir), Net_DAC-CLK (bidir), Net_DAC-PD (bidir), RX/TX (bidir)

### Nets
+1.2V: FB13.2 FB14.2 U3.5(VCCINT) U3.29(VCCINT) U3.45(VCCINT) U3.61(VCCINT) U3.78(VCCINT) U3.102(VCCINT) U3.116(VCCINT) U3.134(VCCINT)
+2.5V: U3.35(VCCA1) U3.96(MSELE1) U3.107(VCCA2)
+3.3V: R9.1 R10.1 R60.1 U2.3(WP) U2.7(HOLD) U2.8(VDD) U3.17(VCC101) U3.26(VCC102) U3.40(VCC103) U3.47(VCC103) U3.56(VCC104) U3.62(VCC104) U3.81(VCC105) U3.93(VCC106) U3.117(VCC107) U3.122(VCC107) U3.130(VCC108) U3.139(VCC108) X2.4
GND: C203.1 C204.1 R59.1 U2.4(GND) U3.4(GND) U3.19(GND) U3.22(GND) U3.27(GND) U3.36(GNDA1) U3.41(GND) U3.48(GND) U3.57(GND) U3.63(GND) U3.79(GND) U3.82(GND) U3.94(MSELE0) U3.95(GND) U3.97(GND) U3.108(GNDA2) U3.118(GND) U3.123(GND) U3.131(GND) U3.140(GND) U3.145(GND) X2.2 X2.10
ATT_ON_0.5: U3.86(Column_I/O) ; port ATT_ON_0.5
ATT_ON_1: U3.87(Column_I/O) ; port ATT_ON_1
ATT_ON_2: U3.98(Column_I/O) ; port ATT_ON_2
ATT_ON_4: U3.99(Column_I/O) ; port ATT_ON_4
ATT_ON_8: U3.100(Column_I/O) ; port ATT_ON_8
ATT_ON_16: U3.85(Column_I/O) ; port ATT_ON_16
AUDIO_I2S_CLOCK: U3.136(Column_I/O_VREFB8NO) ; port AUDIO_I2S_CLOCK
BPF_A: U3.80(Column_I/O) ; port BPF_A
BPF_B: U3.83(Column_I/O) ; port BPF_B
BPF_OE1: U3.77(Column_I/O) ; port BPF_OE1
BPF_OE2: U3.84(Column_I/O) ; port BPF_OE2
FPG_CTRL: U3.143(Column_I/O) ; port FPG_CTRL
FPGA_48K_CLK: U3.135(Column_I/O) ; port FPGA_48K_CLK
FPGA_BUS_CLK: U3.33(Row_I/O) ; port FPGA_BUS_CLK
FPGA_BUS_D0: U3.49(Column_I/O) ; port FPGA_BUS_D0
FPGA_BUS_D1: U3.50(Column_I/O) ; port FPGA_BUS_D1
FPGA_BUS_D2: U3.51(Column_I/O) ; port FPGA_BUS_D2
FPGA_BUS_D3: U3.38(Column_I/O) ; port FPGA_BUS_D3
FPGA_BUS_D4: U3.39(Column_I/O) ; port FPGA_BUS_D4
FPGA_BUS_D5: U3.42(Column_I/O) ; port FPGA_BUS_D5
FPGA_BUS_D6: U3.43(Column_I/O) ; port FPGA_BUS_D6
FPGA_BUS_D7: U3.46(Column_I/O) ; port FPGA_BUS_D7
FPGA_BUS_SYNC: U3.32(Row_I/O) ; port FPGA_BUS_SYNC
LPF1: U3.76(Column_I/O) ; port LPF1
LPF2: U3.75(Column_I/O) ; port LPF2
LPF3: U3.74(Column_I/O) ; port LPF3
LTC_ENABLE: U3.69(Column_I/O) ; port LTC_ENABLE
Net-bit1: U3.52(Dedicated_Clock) ; port Net-bit1
Net-bit2: U3.53(Dedicated_Clock) ; port Net-bit2
Net-bit3: U3.54(Dedicated_Clock) ; port Net-bit3
Net-bit4: U3.55(Dedicated_Clock) ; port Net-bit4
Net-bit5: U3.58(Column_I/O) ; port Net-bit5
Net-bit6: U3.59(Column_I/O) ; port Net-bit6
Net-bit7: U3.60(Column_I/O) ; port Net-bit7
Net-bit8: U3.64(Column_I/O) ; port Net-bit8
Net-bit9: U3.65(Column_I/O_VREFB4NO) ; port Net-bit9
Net-bit10: U3.66(Column_I/O) ; port Net-bit10
Net-bit11: U3.67(Column_I/O) ; port Net-bit11
Net-bit12: U3.68(Column_I/O) ; port Net-bit12
Net-Clock: U3.89(Dedicated_Clock) ; port Net-Clock
Net-otr: U3.44(Column_I/O) ; port Net-otr
Net_DAC0: U3.101(Column_I/O) ; port Net_DAC0
Net_DAC1: U3.103(Row_I/O) ; port Net_DAC1
Net_DAC2: U3.104(Row_I/O) ; port Net_DAC2
Net_DAC3: U3.105(Row_I/O_VREFB6NO) ; port Net_DAC3
Net_DAC4: U3.106(Row_I/O) ; port Net_DAC4
Net_DAC5: U3.110(Column_I/O) ; port Net_DAC5
Net_DAC6: U3.111(Column_I/O) ; port Net_DAC6
Net_DAC7: U3.112(Column_I/O) ; port Net_DAC7
Net_DAC8: U3.113(Column_I/O) ; port Net_DAC8
Net_DAC9: U3.114(Column_I/O_VREFB4N0) ; port Net_DAC9
Net_DAC10: U3.115(Column_I/O) ; port Net_DAC10
Net_DAC11: U3.119(Column_I/O) ; port Net_DAC11
Net_DAC12: U3.120(Column_I/O) ; port Net_DAC12
Net_DAC13: U3.121(Dedicated_Clock) ; port Net_DAC13
Net_DAC-CLK: U3.125(MSEL2) ; port Net_DAC-CLK
Net_DAC-PD: U3.124(Column_I/O) ; port Net_DAC-PD
RX/TX: U3.72(Column_I/O) ; port RX/TX
TCK: U3.16(JTAG) X2.1
TDI: U3.15(JTAG) X2.9
TDO: U3.20(JTAG) X2.3
TMS: U3.18(JTAG) X2.5
NetC203_2: C203.2 FB13.1 U3.37(VCCINT)
NetC204_2: C204.2 FB14.1 U3.109(VCCINT)
NetR9_2: R9.2 U3.9(nSTATUS)
NetR10_2: R10.2 U3.14(nCONFIG)
NetR59_2: R59.2 U3.21(nCE)
NetR60_2: R60.2 U3.92
NetU2_1: U2.1(nCE) U3.8(Row_I/Q)
NetU2_2: U2.2(SO) U3.13(Row_I/Q)
NetU2_5: U2.5(SI) U3.6(Row_I/Q)
NetU2_6: U2.6(SCK) U3.12(UDCLK)

Not connected (* = marked no-connect by the designer): U3 73(Column_I/O); X2 6* 7* 8*

### Notes on the sheet
- Labels drawn without touching a wire or pin: FPGA_BUS_D3
- Перв. примен.
- Справ. №
- Подп. и дата
- Инв. № дубл.
- Взам. инв. №
- Инв. № подл.
- Изм.
- Лист
- № докум.
- Подп.
- Дата
- 2.106-A2
- Копировал
- Формат А2

### Library data of the parts
C203 C204 = Capacitor: Manufacturer: *; Model: *; HelpURL: *; ComponentKind: *; Value: *
FB13 FB14 = Inductor: Manufacturer: *; Model: *; HelpURL: *; ComponentKind: *; Value: *
R9 R10 R59 R60 = Resistor: Manufacturer: *; Model: *; HelpURL: *; ComponentKind: *; Value: *
U3 = EP4CE10E22C8N

## Sheet WL-DAC904.SchDoc
size 594 x 420 mm; Address1: Address1; Address2: Address2; Address3: Address3; Address4: Address4; DocumentNumber: Wolf-Lite; SheetNumber: 5; Scale: 1:1; DocumentType: Схема электрическая принципиальная; FirstReferrence: UA3REO/R7KBI
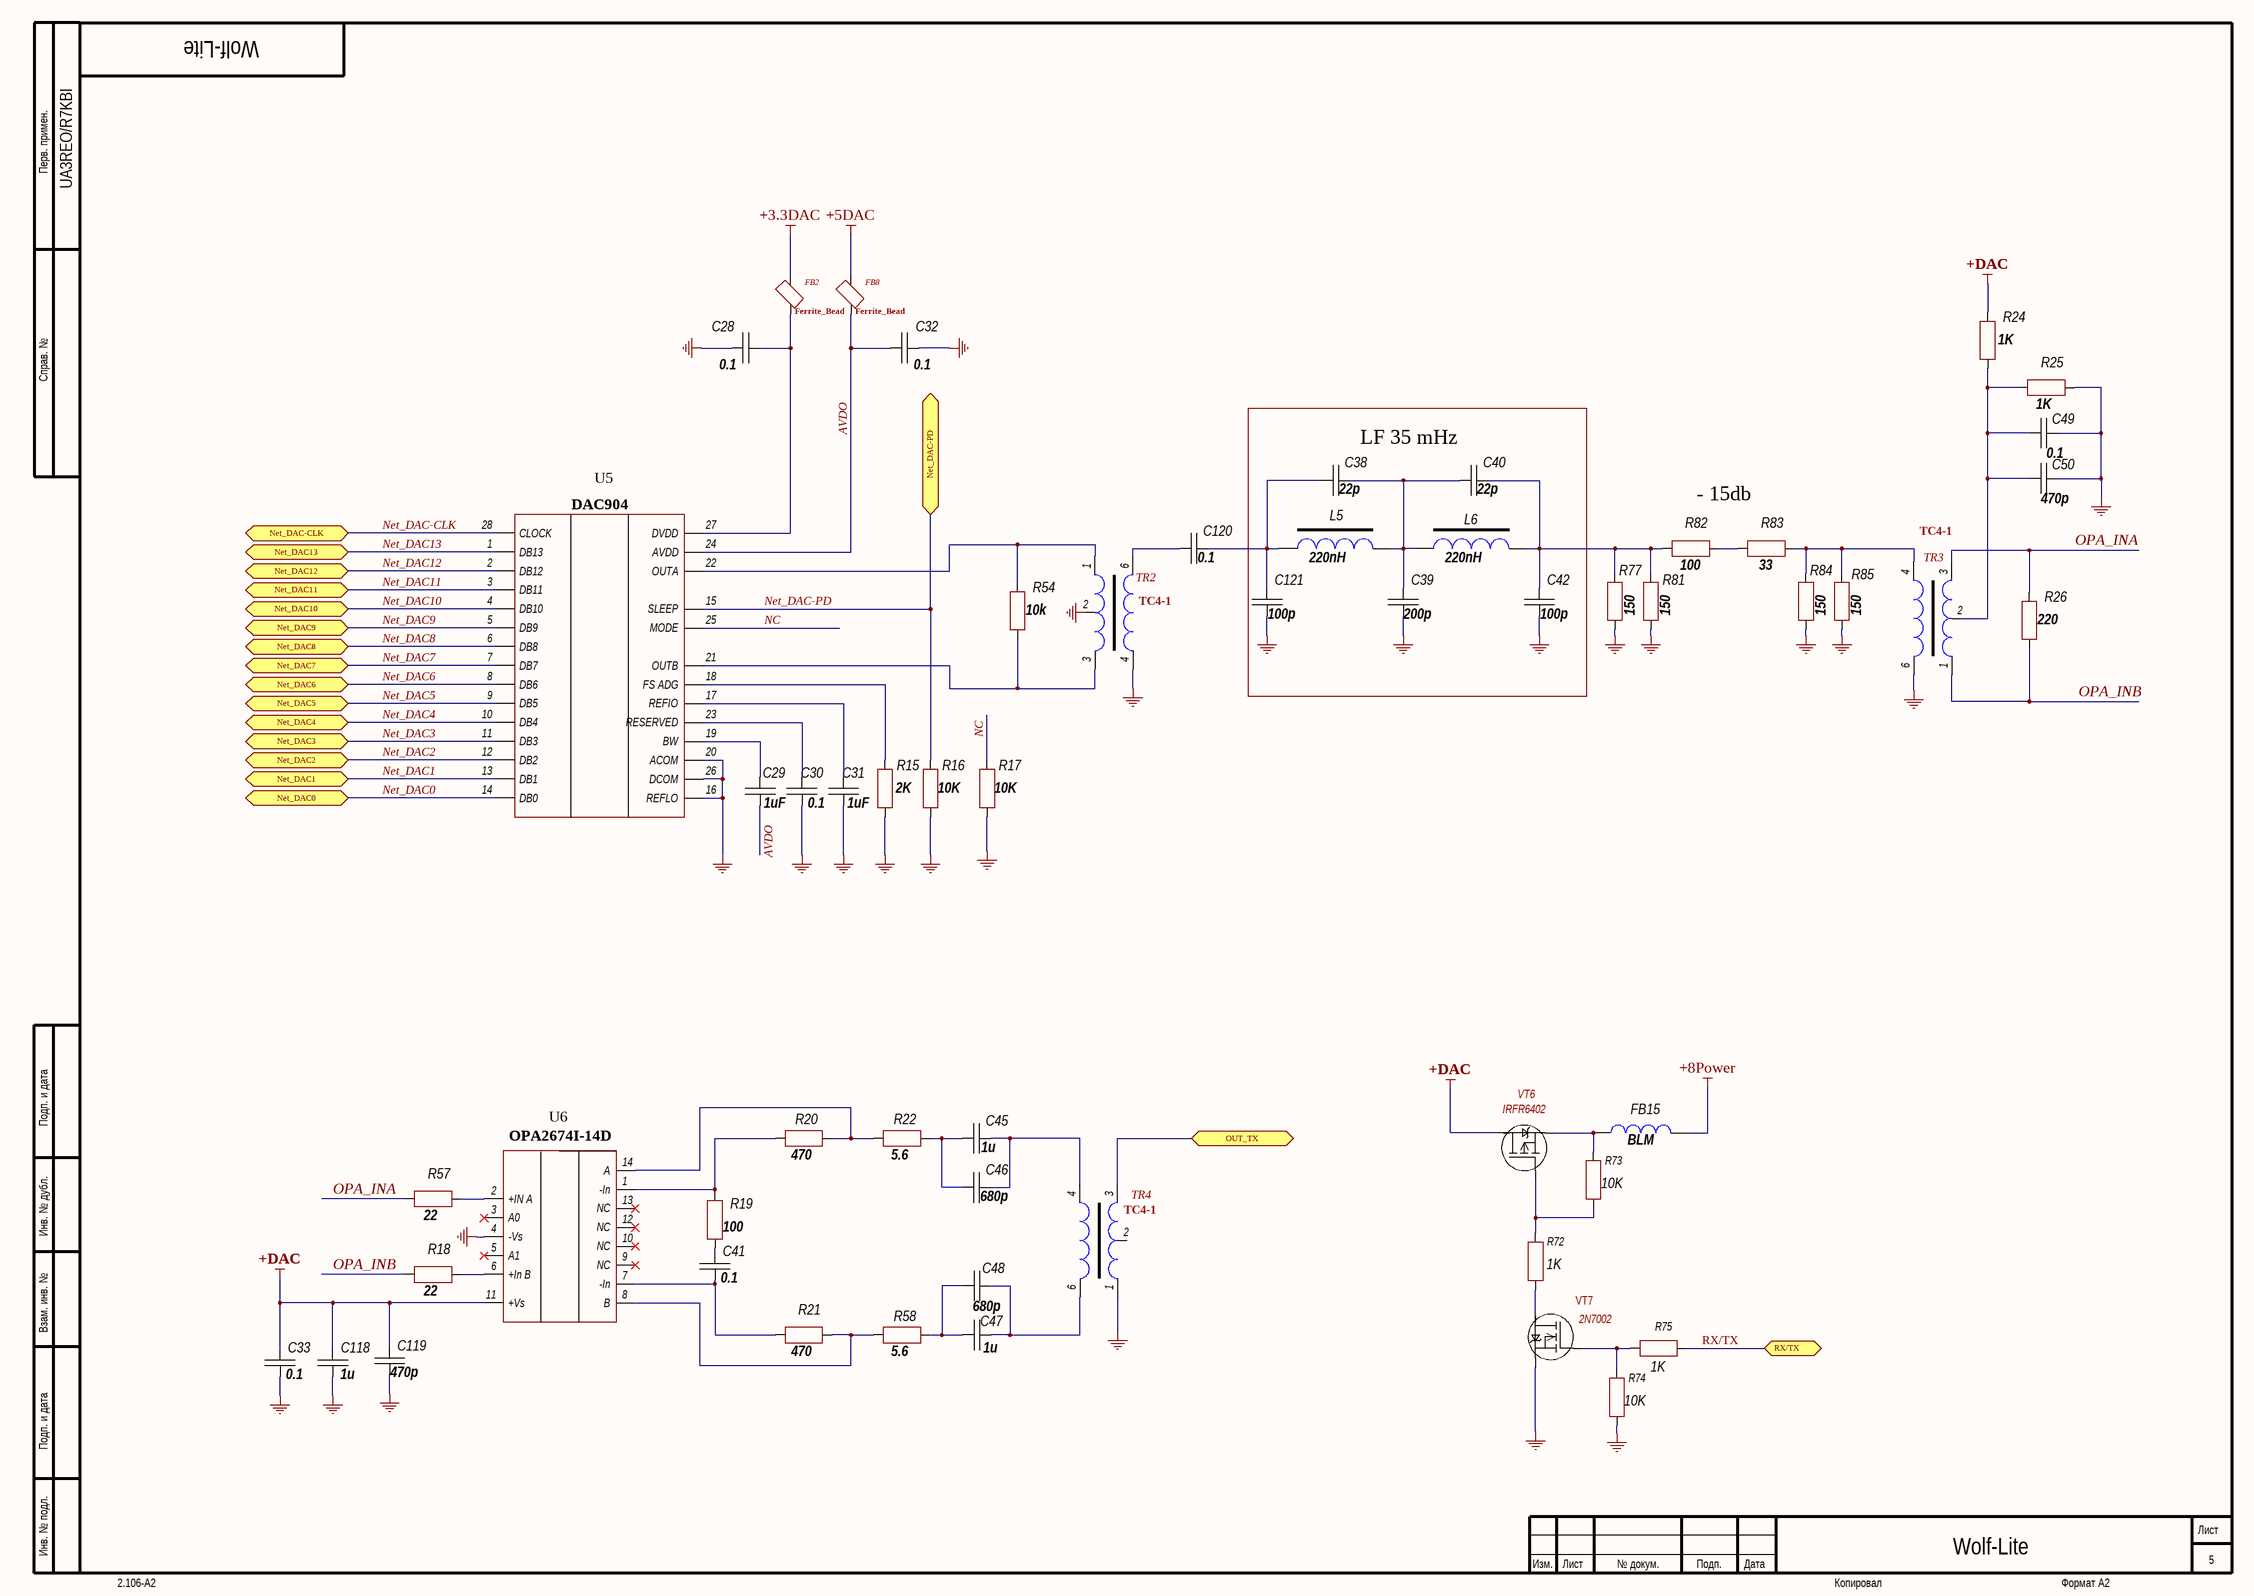
[diagram p4: WL-DAC904.SchDoc]

### Parts
C28  0.1  [CH0805C]
C29  1uF  [CH0805C]
C30  0.1  [CH0805C]
C31  1uF  [CH0805C]
C32  0.1  [CH0805C]
C33  0.1  [CH0805C]
C38  22p  [CH0805C]
C39  200p  [CH0805C]
C40  22p  [CH0805C]
C41  0.1  [CH0805C]
C42  100p  [CH0805C]
C45  1u  [CH0805C]
C46  680p  [CH0805C]
C47  1u  [CH0805C]
C48  680p  [CH0805C]
C49  0.1  [CH0805C]
C50  470p  [CH0805C]
C118  1u  [CH0805C]
C119  470p  [CH0805C]
C120  0.1  [CH0805C]
C121  100p  [CH0805C]
FB2  Ferrite_Bead  [CH0805L]
FB8  Ferrite_Bead  [CH0805L]
FB15  BLM  [CH0805L]
L5  220nH  [L1210]
L6  220nH  [L1210]
R15  2K  [CH0805R]
R16  10K  [CH0805R]
R17  10K  [CH0805R]
R18  22  [CH0805R]
R19  100  [CH0805R]
R20  470  [CH0805R]
R21  470  [CH0805R]
R22  5.6  [CH0805R]
R24  1K  [CH0805R]
R25  1K  [CH0805R]
R26  220  [CH0805R]
R54  10k  [CH0805R]
R57  22  [CH0805R]
R58  5.6  [CH0805R]
R72  1K  [CH0805R]
R73  10K  [CH0805R]
R74  10K  [CH0805R]
R75  1K  [CH0805R]
R77  150  [CH0805R]
R81  150  [CH0805R]
R82  100  [CH0805R]
R83  33  [CH0805R]
R84  150  [CH0805R]
R85  150  [CH0805R]
TR2  TC4-1  [TC1-4]
TR3  TC4-1  [TC1-4]
TR4  TC4-1  [TC1-4]
U5  DAC904  [28-TSSOP]
U6  OPA2674I-14D  [14-SOIC]
VT6  IRFR6402  [SOT23_132]
VT7  2N7002  [SOT23_132]

### Blocks framed on the sheet
LF 35 mHz: C38-C40 C42 C121 L5 L6

### Ports
Net_DAC0 (bidir), Net_DAC1 (bidir), Net_DAC2 (bidir), Net_DAC3 (bidir), Net_DAC4 (bidir), Net_DAC5 (bidir), Net_DAC6 (bidir), Net_DAC7 (bidir), Net_DAC8 (bidir), Net_DAC9 (bidir), Net_DAC10 (bidir), Net_DAC11 (bidir), Net_DAC12 (bidir), Net_DAC13 (bidir), Net_DAC-CLK (bidir), Net_DAC-PD (bidir), OUT_TX (bidir), RX/TX (bidir)

### Nets
+3.3DAC: FB2.2
+5DAC: FB8.2
+8Power: FB15.1
+DAC: C33.1 C118.1 C119.1 R24.1 U6.11(+Vs) VT6.3(Сток(Drain))
GND: C28.2 C30.2 C31.2 C32.2 C33.2 C39.1 C42.1 C49.1 C50.1 C118.2 C119.2 C121.1 R15.1 R16.1 R17.1 R25.2 R74.1 R77.1 R81.1 R84.1 R85.1 TR2.2 TR2.4 TR3.6 TR4.1 U5.16(REFLO) U5.20(ACOM) U5.26(DCOM) U6.4(-Vs) VT7.2(I)
AVDO: C29.2 C32.1 FB8.1 U5.24(AVDD)
NC: R17.2 U5.25(MODE)
Net_DAC0: U5.14(DB0) ; port Net_DAC0
Net_DAC1: U5.13(DB1) ; port Net_DAC1
Net_DAC2: U5.12(DB2) ; port Net_DAC2
Net_DAC3: U5.11(DB3) ; port Net_DAC3
Net_DAC4: U5.10(DB4) ; port Net_DAC4
Net_DAC5: U5.9(DB5) ; port Net_DAC5
Net_DAC6: U5.8(DB6) ; port Net_DAC6
Net_DAC7: U5.7(DB7) ; port Net_DAC7
Net_DAC8: U5.6(DB8) ; port Net_DAC8
Net_DAC9: U5.5(DB9) ; port Net_DAC9
Net_DAC10: U5.4(DB10) ; port Net_DAC10
Net_DAC11: U5.3(DB11) ; port Net_DAC11
Net_DAC12: U5.2(DB12) ; port Net_DAC12
Net_DAC13: U5.1(DB13) ; port Net_DAC13
Net_DAC-CLK: U5.28(CLOCK) ; port Net_DAC-CLK
Net_DAC-PD: R16.2 U5.15(SLEEP) ; port Net_DAC-PD
OPA_INA: R26.1 R57.1 TR3.3
OPA_INB: R18.1 R26.2 TR3.1
RX/TX: R75.1 ; port RX/TX
NetC28_1: C28.1 FB2.1 U5.27(DVDD)
NetC29_1: C29.1 U5.19(BW)
NetC30_1: C30.1 U5.23(RESERVED)
NetC31_1: C31.1 U5.17(REFIO)
NetC38_1: C38.1 C120.2 C121.2 L5.1
NetC38_2: C38.2 C39.2 C40.1 L5.2 L6.1
NetC40_2: C40.2 C42.2 L6.2 R77.2 R81.2 R82.1
NetC41_1: C41.1 R19.1
NetC41_2: C41.2 R21.1 U6.7(-In)
NetC45_1: C45.1 C46.1 R22.2
NetC45_2: C45.2 C46.2 TR4.4
NetC47_1: C47.1 C48.1 R58.2
NetC47_2: C47.2 C48.2 TR4.6
NetC49_2: C49.2 C50.2 R24.2 R25.1 TR3.2
NetC120_1: C120.1 TR2.6
NetFB15_2: FB15.2 R73.2 VT6.2(I)
NetK1_4: TR4.3 ; port OUT_TX
NetR15_2: R15.2 U5.18(FS_ADG)
NetR18_2: R18.2 U6.6(+In_B)
NetR19_2: R19.2 R20.1 U6.1(-In)
NetR20_2: R20.2 R22.1 U6.14(A)
NetR21_2: R21.2 R58.1 U6.8(B)
NetR54_1: R54.1 TR2.1 U5.22(OUTA)
NetR54_2: R54.2 TR2.3 U5.21(OUTB)
NetR57_2: R57.2 U6.2(+IN_A)
NetR72_1: R72.1 VT7.3(Сток(Drain))
NetR72_2: R72.2 R73.1 VT6.1(Затвор(Gate))
NetR74_2: R74.2 R75.2 VT7.1(Затвор(Gate))
NetR82_2: R82.2 R83.1
NetR83_2: R83.2 R84.2 R85.2 TR3.4

Not connected (* = marked no-connect by the designer): TR4 2; U6 3(A0)* 5(A1)* 9(NC)* 10(NC)* 12(NC)* 13(NC)*

### Notes on the sheet
- - 15db
- Перв. примен.
- Справ. №
- Подп. и дата
- Инв. № дубл.
- Взам. инв. №
- Инв. № подл.
- Изм.
- Лист
- № докум.
- Подп.
- Дата
- 2.106-A2
- Копировал
- Формат А2

### Library data of the parts
C28-C33 C38-C42 C45-C50 C118-C121 = Capacitor: Manufacturer: *; Model: *; HelpURL: *; ComponentKind: *; Value: *
FB2 FB8 = FB
FB15 = Inductor: Manufacturer: *; Model: *; HelpURL: *; ComponentKind: *; Value: *
L5 L6 = TRANS
R15-R22 R24-R26 R54 R57 R58 R72-R75 R77 R81-R85 = Resistor: Manufacturer: *; Model: *; HelpURL: *; ComponentKind: *; Value: *
U6 = OPA2674
VT6 = P-KANAL
VT7 = N-KANAL

## Sheet WL-ATT.SchDoc
size 420 x 297 mm; Address1: Address1; Address2: Address2; Address3: Address3; Address4: Address4; DocumentNumber: Wolf-Lite; SheetNumber: 7; Scale: 1:1; DocumentType: Схема электрическая принципиальная; FirstReferrence: UA3REO/R7KBI
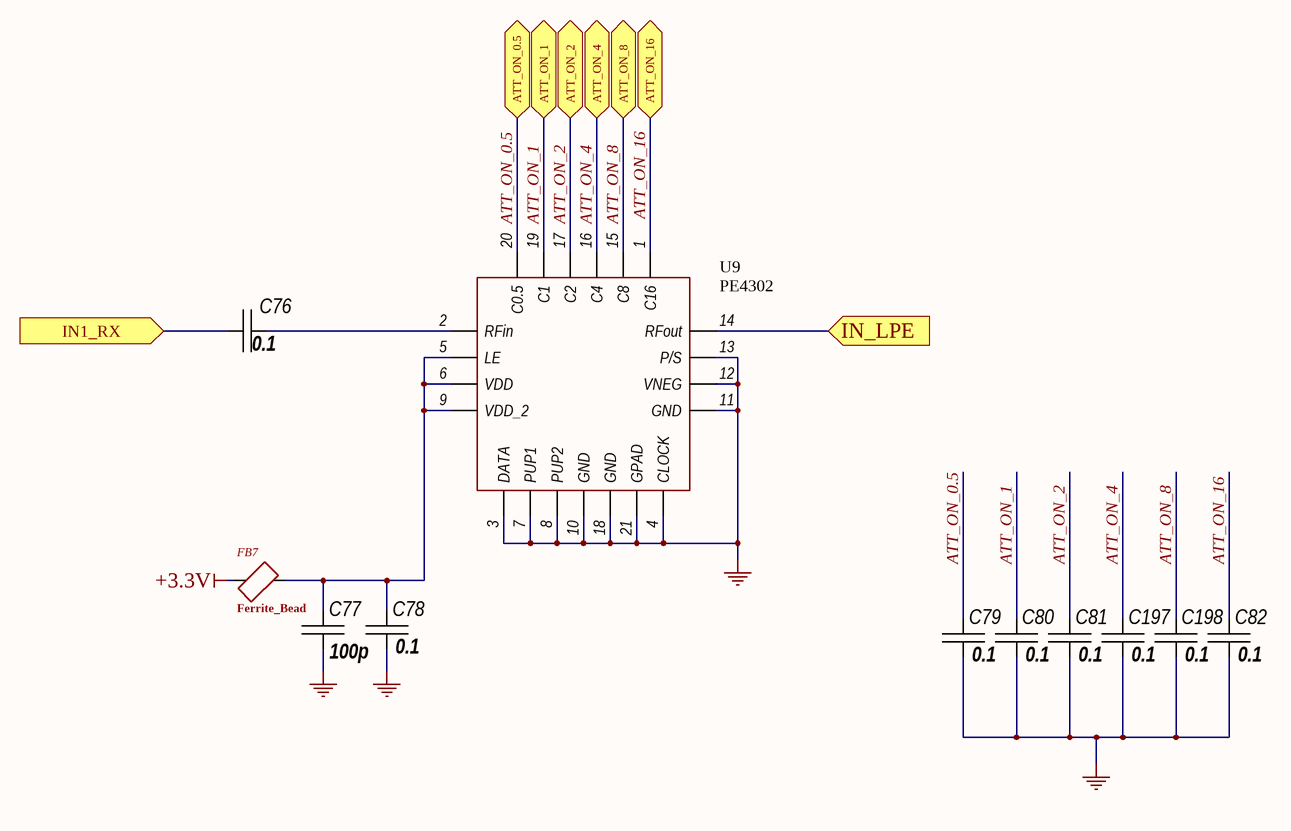
[diagram p5: WL-ATT.SchDoc]

### Parts
C76  0.1  [CH0805C]
C77  100p  [CH0805C]
C78  0.1  [CH0805C]
C79  0.1  [CH0805C]
C80  0.1  [CH0805C]
C81  0.1  [CH0805C]
C82  0.1  [CH0805C]
C197  0.1  [CH0805C]
C198  0.1  [CH0805C]
FB7  Ferrite_Bead  [CH0805L]
U9  PE4302  [20-QFN (4x4)]

### Ports
ATT_ON_0.5 (bidir), ATT_ON_1 (bidir), ATT_ON_2 (bidir), ATT_ON_4 (bidir), ATT_ON_8 (bidir), ATT_ON_16 (bidir), IN1_RX (in), IN_LPE (in)

### Nets
+3.3V: FB7.2
GND: C77.1 C78.1 C79.1 C80.1 C81.1 C82.1 C197.1 C198.1 U9.3(DATA) U9.4(CLOCK) U9.7(PUP1) U9.8(PUP2) U9.10(GND) U9.11(GND) U9.12(VNEG) U9.13(P/S) U9.18(GND) U9.21(GPAD)
ATT_ON_0.5: C79.2 U9.20(C0.5) ; port ATT_ON_0.5
ATT_ON_1: C80.2 U9.19(C1) ; port ATT_ON_1
ATT_ON_2: C81.2 U9.17(C2) ; port ATT_ON_2
ATT_ON_4: C197.2 U9.16(C4) ; port ATT_ON_4
ATT_ON_8: C198.2 U9.15(C8) ; port ATT_ON_8
ATT_ON_16: C82.2 U9.1(C16) ; port ATT_ON_16
IN_LPE: U9.14(RFout) ; port IN_LPE
NetC76_1: C76.1 ; port IN1_RX
NetC76_2: C76.2 U9.2(RFin)
NetC77_2: C77.2 C78.2 FB7.1 U9.5(LE) U9.6(VDD) U9.9(VDD_2)

### Notes on the sheet
- Подп. и дата
- Инв. № дубл.
- Взам. инв. №
- Инв. № подл.
- Изм.
- Лист
- № докум.
- Подп.
- Дата
- 2.106-A3
- Копировал
- Формат А3

### Library data of the parts
C76-C82 C197 C198 = Capacitor: Manufacturer: *; Model: *; HelpURL: *; ComponentKind: *; Value: *
FB7 = FB

## Sheet WL-CPU-V1.0.SchDoc
size 594 x 420 mm; Address1: Address1; Address2: Address2; Address3: Address3; Address4: Address4; DocumentNumber: Wolf-Lite; SheetNumber: 2; Scale: 1:1; DocumentType: Схема электрическая принципиальная; FirstReferrence: UA3REO/R7KBI
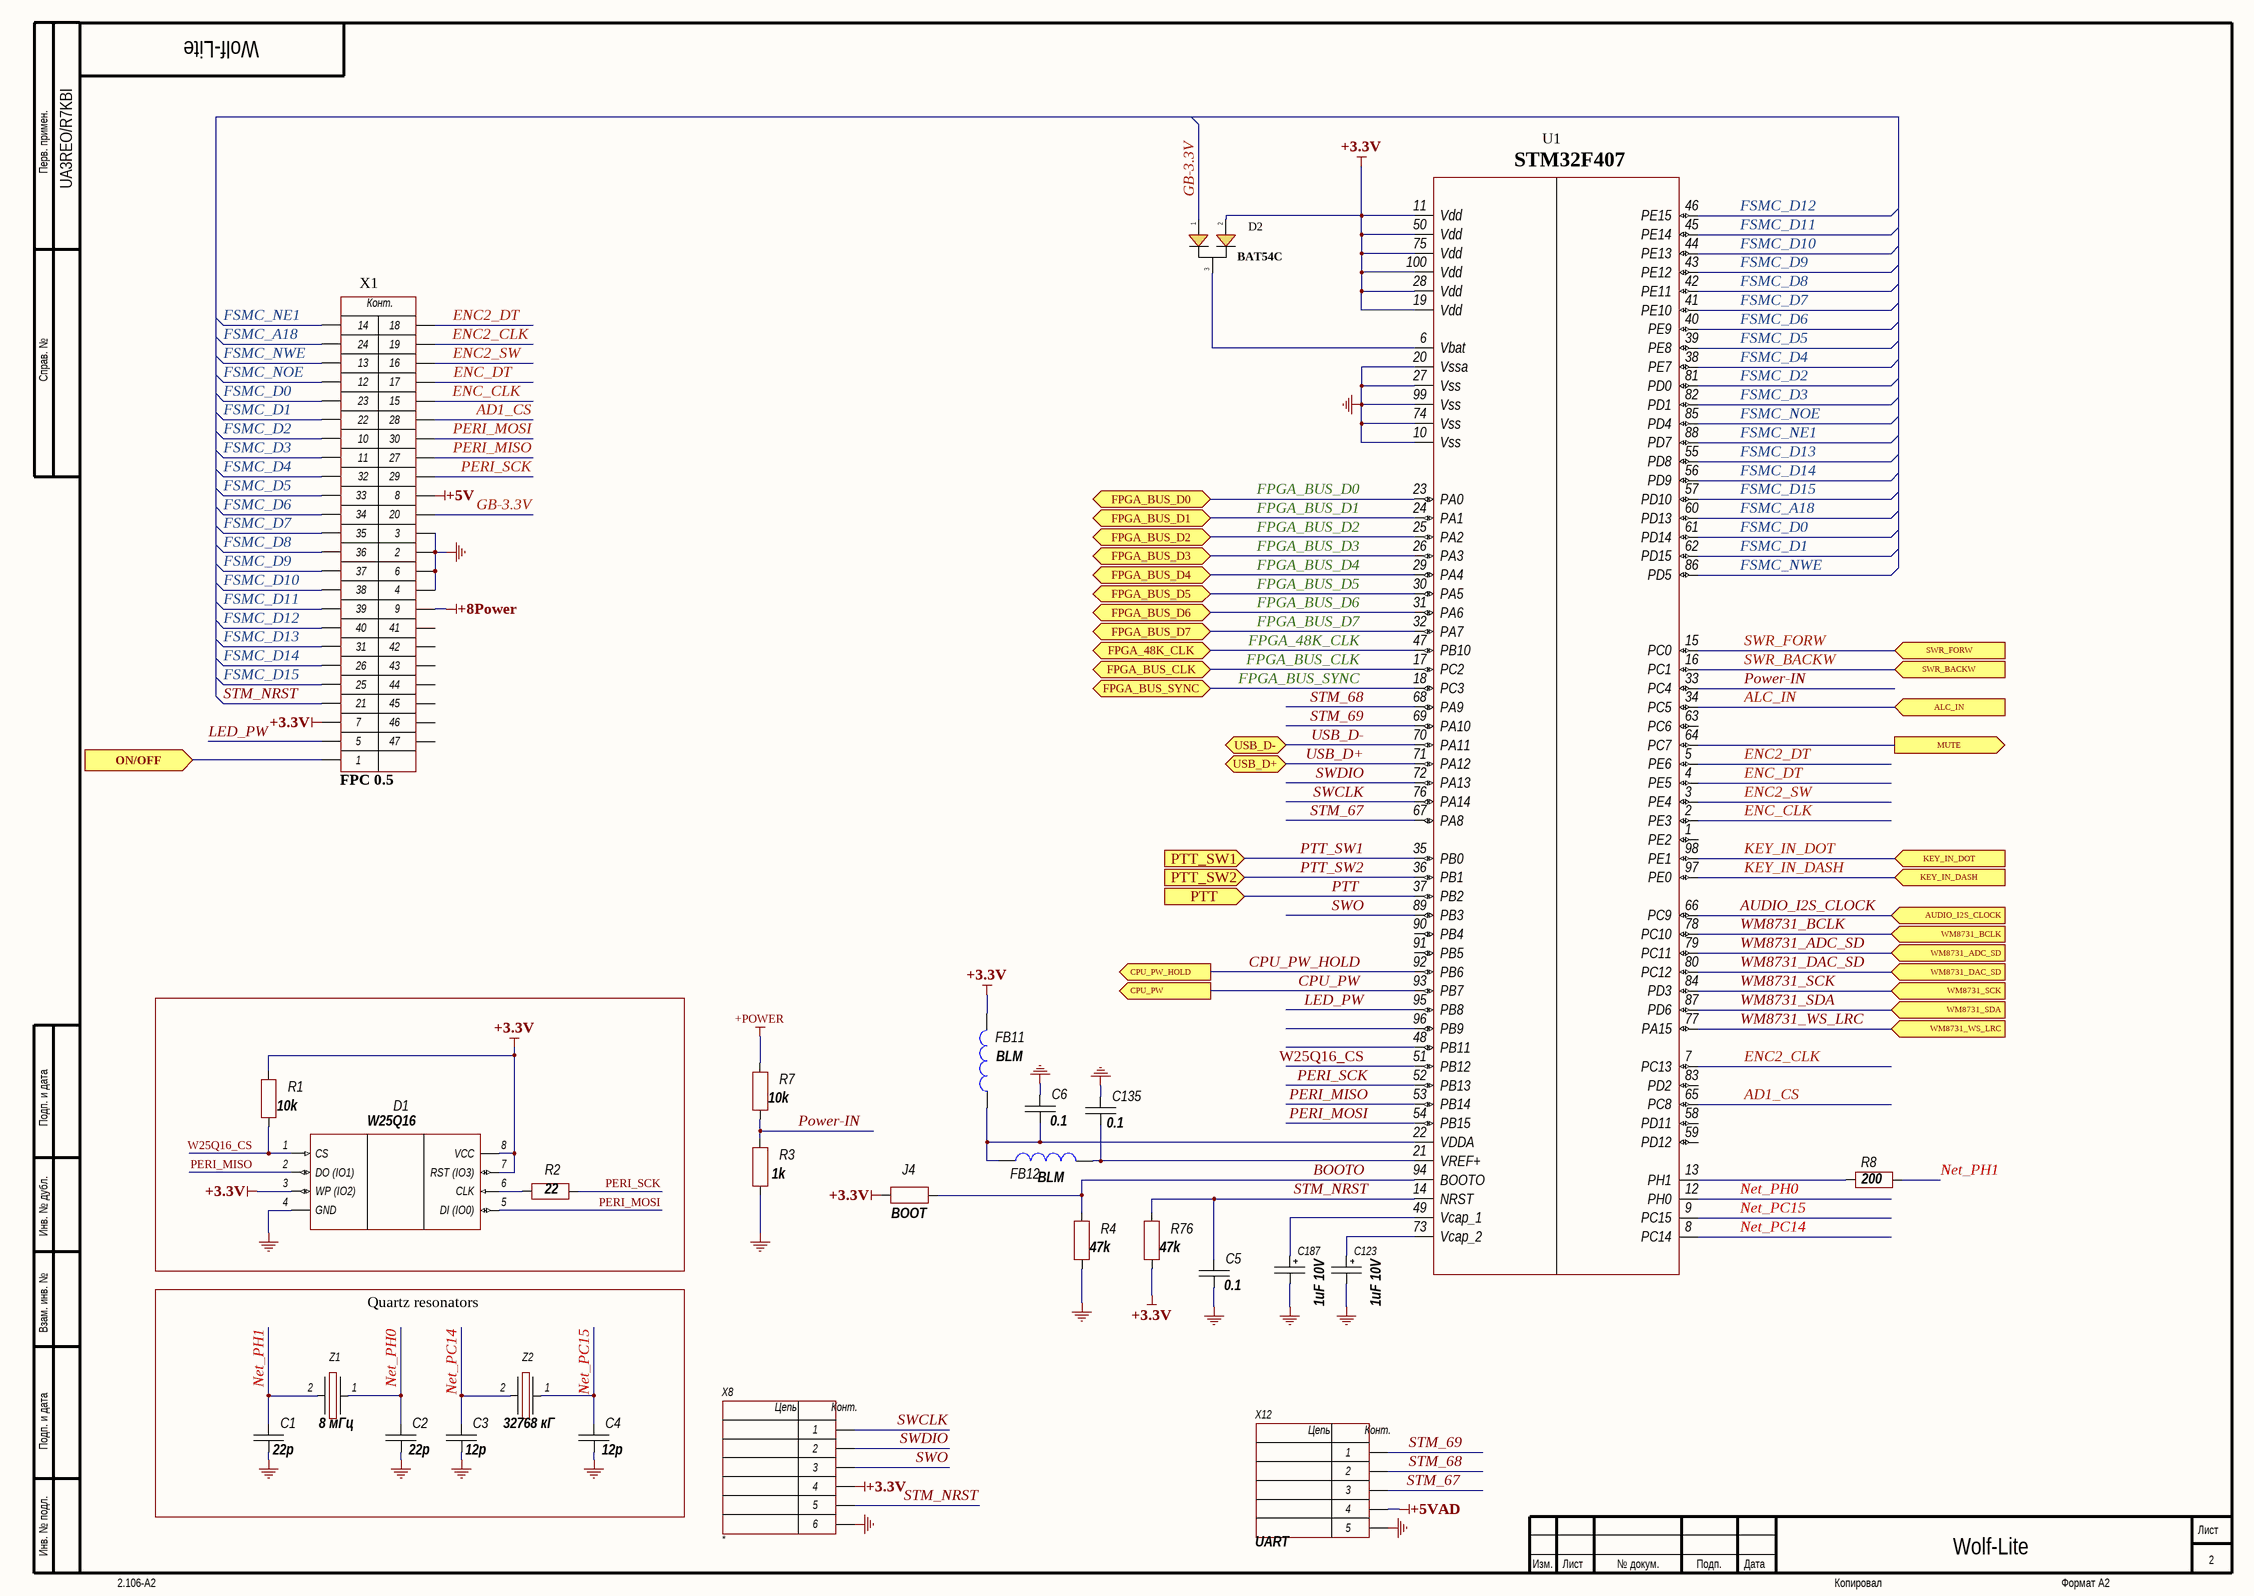
[diagram p6: WL-CPU-V1.0.SchDoc]

### Parts
C1  22p  [CH0805C]
C2  22p  [CH0805C]
C3  12p  [CH0805C]
C4  12p  [CH0805C]
C5  0.1  [CH0805C]
C6  0.1  [CH0805C]
C123  1uF 10V  [TANTAL_A]
C135  0.1  [CH0805C]
C187  1uF 10V  [TANTAL_A]
D1  W25Q16  [SOIC-8-1]
D2  BAT54C  [SOT23_132]
FB11  BLM  [CH0805L]
FB12  BLM  [CH0805L]
J4  BOOT  [CH0805R]
R1  10k  [CH0805R]
R2  22  [CH0805R]
R3  1k  [CH0805R]
R4  47k  [CH0805R]
R7  10k  [CH0805R]
R8  200  [CH0805R]
R76  47k  [CH0805R]
U1  STM32F407  [100-LQFP]
X1  FPC 0.5  [CON: PLD2X20]
X8  *  [CON: PLD-6]
X12  UART  [CON: PLS-5]
Z1  8 мГц  [OSC-dip]
Z2  32768 кГ  [Qz]

### Blocks framed on the sheet
Quartz resonators: C1-C4 Z1 Z2

### Ports
ALC_IN (in), AUDIO_I2S_CLOCK (in), CPU_PW (out), CPU_PW_HOLD (out), FPGA_48K_CLK (bidir), FPGA_BUS_CLK (bidir), FPGA_BUS_D0 (bidir), FPGA_BUS_D1 (bidir), FPGA_BUS_D2 (bidir), FPGA_BUS_D3 (bidir), FPGA_BUS_D4 (bidir), FPGA_BUS_D5 (bidir), FPGA_BUS_D6 (bidir), FPGA_BUS_D7 (bidir), FPGA_BUS_SYNC (bidir), KEY_IN_DASH (in), KEY_IN_DOT (in), MUTE (out), ON/OFF (in), PTT (in), PTT_SW1 (in), PTT_SW2 (in), SWR_BACKW (in), SWR_FORW (in), USB_D+ (bidir), USB_D- (bidir), WM8731_ADC_SD (in), WM8731_BCLK (in), WM8731_DAC_SD (in), WM8731_SCK (in), WM8731_SDA (in), WM8731_WS_LRC (in)

### Nets
+3.3V: D1.3(WP_(IO2)) D1.7(RST_(IO3)) D1.8(VCC) D2.2 FB11.1 J4.2 R1.2 R76.1 U1.11(Vdd) U1.19(Vdd) U1.28(Vdd) U1.50(Vdd) U1.75(Vdd) U1.100(Vdd) X1.7 X8.4
+5V: X1.8
+5VAD: X12.4
+8Power: X1.9
+POWER: R7.2  [project net POWER-ON]
GND: C1.1 C2.1 C3.1 C4.1 C5.1 C6.2 C123.2 C135.2 C187.2 D1.4(GND) R3.1 R4.1 U1.10(Vss) U1.20(Vssa) U1.27(Vss) U1.74(Vss) U1.99(Vss) X1.2 X1.3 X1.4 X1.6 X8.6 X12.5
AD1_CS: U1.65(PC8) X1.28
ALC_IN: U1.34(PC5) ; port ALC_IN
AUDIO_I2S_CLOCK: U1.66(PC9) ; port AUDIO_I2S_CLOCK
BOOTO: J4.1 R4.2 U1.94(BOOTO)
CPU_PW: U1.93(PB7) ; port CPU_PW
CPU_PW_HOLD: U1.92(PB6) ; port CPU_PW_HOLD
ENC2_CLK: U1.7(PC13) X1.19
ENC2_DT: U1.5(PE6) X1.18
ENC2_SW: U1.3(PE4) X1.16
ENC_CLK: U1.2(PE3) X1.15
ENC_DT: U1.4(PE5) X1.17
FPGA_48K_CLK: U1.47(PB10) ; port FPGA_48K_CLK
FPGA_BUS_CLK: U1.17(PC2) ; port FPGA_BUS_CLK
FPGA_BUS_D0: U1.23(PA0) ; port FPGA_BUS_D0
FPGA_BUS_D1: U1.24(PA1) ; port FPGA_BUS_D1
FPGA_BUS_D2: U1.25(PA2) ; port FPGA_BUS_D2
FPGA_BUS_D3: U1.26(PA3) ; port FPGA_BUS_D3
FPGA_BUS_D4: U1.29(PA4) ; port FPGA_BUS_D4
FPGA_BUS_D5: U1.30(PA5) ; port FPGA_BUS_D5
FPGA_BUS_D6: U1.31(PA6) ; port FPGA_BUS_D6
FPGA_BUS_D7: U1.32(PA7) ; port FPGA_BUS_D7
FPGA_BUS_SYNC: U1.18(PC3) ; port FPGA_BUS_SYNC
FSMC_A18: U1.60(PD13) X1.24
FSMC_D0: U1.61(PD14) X1.23
FSMC_D1: U1.62(PD15) X1.22
FSMC_D2: U1.81(PD0) X1.10
FSMC_D3: U1.82(PD1) X1.11
FSMC_D4: U1.38(PE7) X1.32
FSMC_D5: U1.39(PE8) X1.33
FSMC_D6: U1.40(PE9) X1.34
FSMC_D7: U1.41(PE10) X1.35
FSMC_D8: U1.42(PE11) X1.36
FSMC_D9: U1.43(PE12) X1.37
FSMC_D10: U1.44(PE13) X1.38
FSMC_D11: U1.45(PE14) X1.39
FSMC_D12: U1.46(PE15) X1.40
FSMC_D13: U1.55(PD8) X1.31
FSMC_D14: U1.56(PD9) X1.26
FSMC_D15: U1.57(PD10) X1.25
FSMC_NE1: U1.88(PD7) X1.14
FSMC_NOE: U1.85(PD4) X1.12
FSMC_NWE: U1.86(PD5) X1.13
GB-3.3V: D2.1 X1.20
KEY_IN_DASH: U1.97(PE0) ; port KEY_IN_DASH
KEY_IN_DOT: U1.98(PE1) ; port KEY_IN_DOT
LED_PW: U1.95(PB8) X1.5
Net_PC14: C3.2 U1.8(PC14) Z2.2
Net_PC15: C4.2 U1.9(PC15) Z2.1
Net_PH0: C2.2 U1.12(PH0) Z1.1
Net_PH1: C1.2 R8.1 Z1.2
PERI_MISO: D1.2(DO_(IO1)) U1.53(PB14) X1.27
PERI_MOSI: D1.5(DI_(IO0)) U1.54(PB15) X1.30
PERI_SCK: R2.2 U1.52(PB13) X1.29
Power-IN: R3.2 R7.1 U1.33(PC4)
PTT: U1.37(PB2) ; port PTT
PTT_SW1: U1.35(PB0) ; port PTT_SW1
PTT_SW2: U1.36(PB1) ; port PTT_SW2
STM_67: U1.67(PA8) X12.3
STM_68: U1.68(PA9) X12.2
STM_69: U1.69(PA10) X12.1
STM_NRST: C5.2 R76.2 U1.14(NRST) X1.21 X8.5
SWCLK: U1.76(PA14) X8.1
SWDIO: U1.72(PA13) X8.2
SWO: U1.89(PB3) X8.3
SWR_BACKW: U1.16(PC1) ; port SWR_BACKW
SWR_FORW: U1.15(PC0) ; port SWR_FORW
USB_D+: U1.71(PA12) ; port USB_D+
USB_D-: U1.70(PA11) ; port USB_D-
W25Q16_CS: D1.1(CS) R1.1 U1.51(PB12)
WM8731_ADC_SD: U1.79(PC11) ; port WM8731_ADC_SD
WM8731_BCLK: U1.78(PC10) ; port WM8731_BCLK
WM8731_DAC_SD: U1.80(PC12) ; port WM8731_DAC_SD
WM8731_SCK: U1.84(PD3) ; port WM8731_SCK
WM8731_SDA: U1.87(PD6) ; port WM8731_SDA
WM8731_WS_LRC: U1.77(PA15) ; port WM8731_WS_LRC
NetC6_1: C6.1 FB11.2 FB12.2 U1.22(VDDA)
NetC123_1: C123.1 U1.73(Vcap_2)
NetC135_1: C135.1 FB12.1 U1.21(VREF+)
NetC187_1: C187.1 U1.49(Vcap_1)
NetD1_6: D1.6(CLK) R2.1
NetD2_3: D2.3 U1.6(Vbat)
NetR8_2: R8.2 U1.13(PH1)
NetR52_1: X1.1 ; port ON/OFF
NetU1_64: U1.64(PC7) ; port MUTE

Not connected (* = marked no-connect by the designer): U1 1(PE2) 48(PB11) 58(PD11) 59(PD12) 63(PC6) 83(PD2) 90(PB4) 91(PB5) 96(PB9); X1 41 42 43 44 45 46 47

### Notes on the sheet
- Перв. примен.
- Справ. №
- Подп. и дата
- Инв. № дубл.
- Взам. инв. №
- Инв. № подл.
- Изм.
- Лист
- № докум.
- Подп.
- Дата
- 2.106-A2
- Копировал
- Формат А2
- (in symbol 5-Connector) Цепь; Конт.
- (in symbol 6-Connector) Цепь; Конт.
- (in symbol FPC-45-0.5) Конт.

### Library data of the parts
C1-C6 C135 = Capacitor: Manufacturer: *; Model: *; HelpURL: *; ComponentKind: *; Value: *
C123 C187 = TantalCap: Manufacturer: *; Model: *; HelpURL: *; ComponentKind: *; Value: *
D1 = W25Q32JVZPIQ: Flash; Manufacturer: Winbond Electronics; Model: W25Q32JVZPIQ; HelpURL: https://www.digikey.com/product-detail/en/winbond-electronics/W25Q32JVZPIQ/W25Q32JVZPIQ-ND/6167525; ComponentKind: 8-WSON
FB11 FB12 = Inductor: Manufacturer: *; Model: *; HelpURL: *; ComponentKind: *; Value: *
J4 R1-R4 R7 R8 R76 = Resistor: Manufacturer: *; Model: *; HelpURL: *; ComponentKind: *; Value: *
U1 = STM32F407-Wolf-lite
X1 = FPC-45-0.5: System: Connector
X8 = 6-Connector: Model: *; Manufacturer: *; HelpURL: *; ComponentKind: *
X12 = 5-Connector: Model: *; Manufacturer: *; HelpURL: *; ComponentKind: *
Z1 Z2 = Oscillator: Manufacturer: *; Model: *; HelpURL: *; ComponentKind: *; Value: *

## Sheet WL-AUDIO.SchDoc
size 594 x 420 mm; Address1: Address1; Address2: Address2; Address3: Address3; Address4: Address4; DocumentNumber: Wolf-Lite; SheetNumber: 6; Scale: 1:1; DocumentType: Схема электрическая принципиальная; FirstReferrence: UA3REO/R7KBI
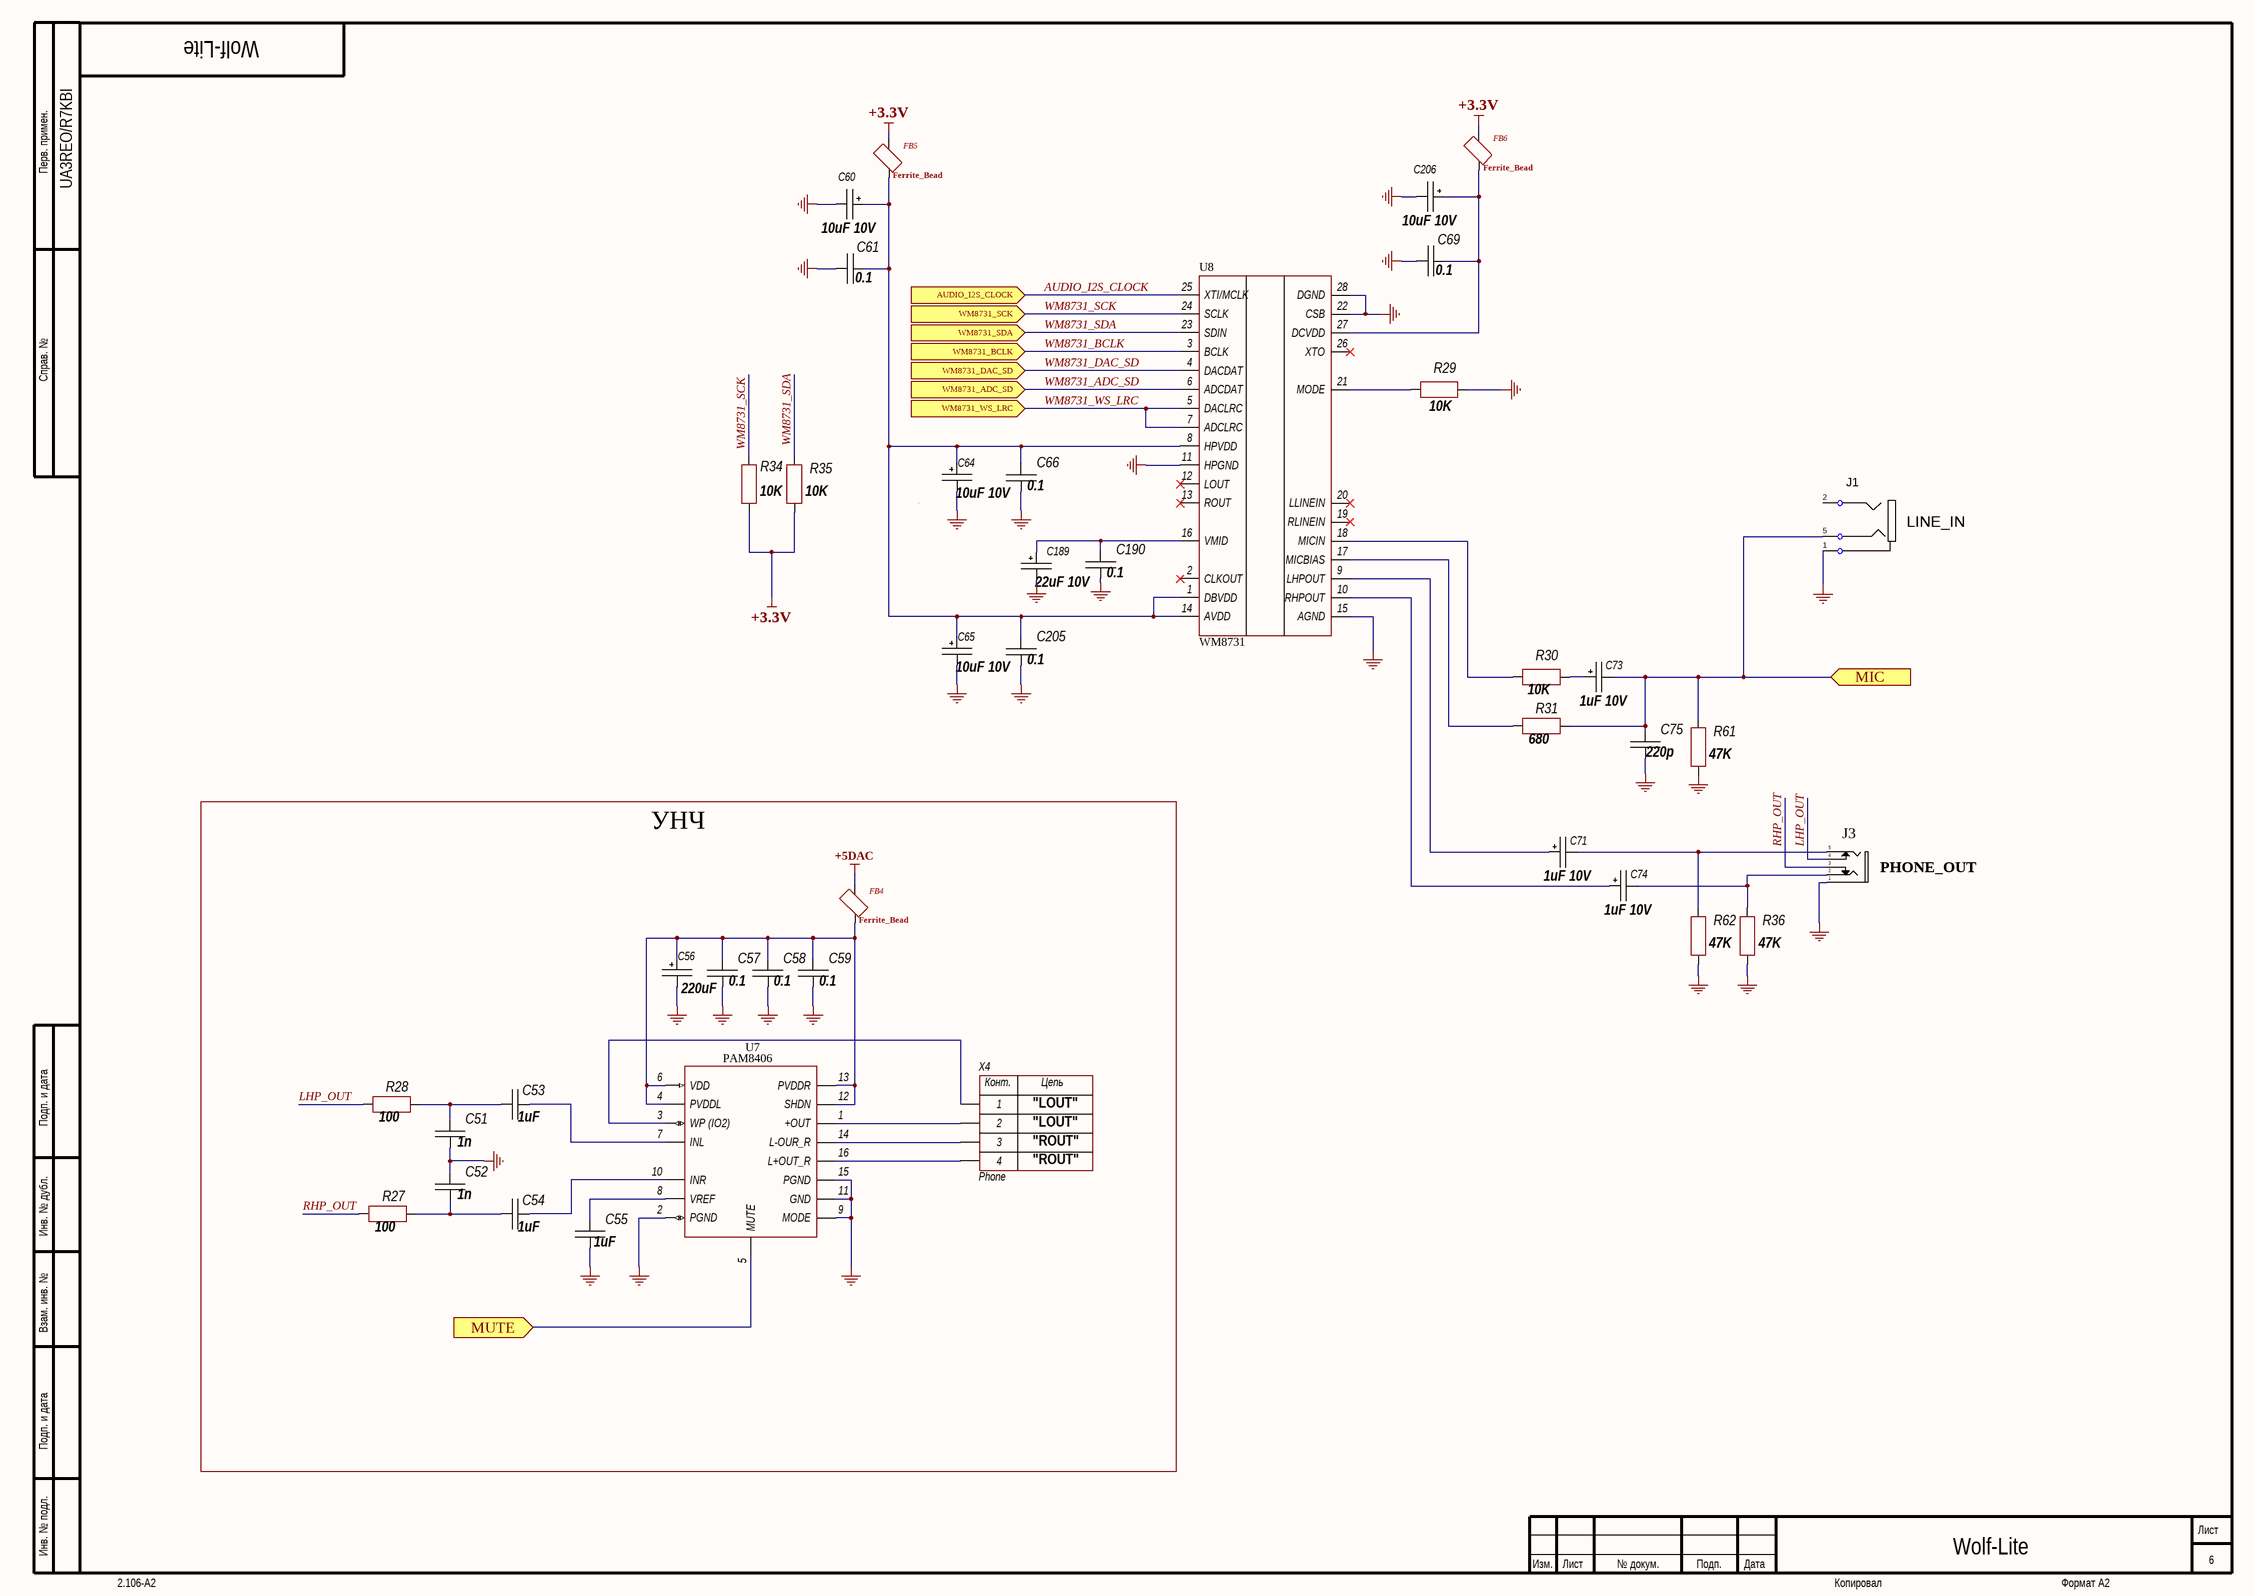
[diagram p7: WL-AUDIO.SchDoc]

### Parts
C51  1n  [CH0805C]
C52  1n  [CH0805C]
C53  1uF  [CH0805C]
C54  1uF  [CH0805C]
C55  1uF  [CH0805C]
C56  220uF  [POLIMER-E]
C57  0.1  [CH0805C]
C58  0.1  [CH0805C]
C59  0.1  [CH0805C]
C60  10uF 10V  [TANTAL_B]
C61  0.1  [CH0805C]
C64  10uF 10V  [TANTAL_B]
C65  10uF 10V  [TANTAL_B]
C66  0.1  [CH0805C]
C69  0.1  [CH0805C]
C71  1uF 10V  [TANTAL_A]
C73  1uF 10V  [TANTAL_A]
C74  1uF 10V  [TANTAL_A]
C75  220p  [CH0805C]
C189  22uF 10V  [TANTAL_B]
C190  0.1  [CH0805C]
C205  0.1  [CH0805C]
C206  10uF 10V  [TANTAL_B]
FB4  Ferrite_Bead  [CH0805L]
FB5  Ferrite_Bead  [CH0805L]
FB6  Ferrite_Bead  [CH0805L]
J1  value LINE_IN  [3.5-stereo]  (hidden comment: SJ1-3525NG)
J3  PHONE_OUT  [3.5-stereo]
R27  100  [CH0805R]
R28  100  [CH0805R]
R29  10K  [CH0805R]
R30  10K  [CH0805R]
R31  680  [CH0805R]
R34  10K  [CH0805R]
R35  10K  [CH0805R]
R36  47K  [CH0805R]
R61  47K  [CH0805R]
R62  47K  [CH0805R]
U7  PAM8406  [SOP-16]
U8  WM8731  [28-SSOP]
X4  Phone  [CON: CWF-4]

### Blocks framed on the sheet
УНЧ: C51-C59 FB4 R27 R28 U7 X4

### Ports
AUDIO_I2S_CLOCK (in), MIC (in), MUTE (in), WM8731_ADC_SD (in), WM8731_BCLK (in), WM8731_DAC_SD (in), WM8731_SCK (in), WM8731_SDA (in), WM8731_WS_LRC (in)

### Nets
+3.3V: FB5.2 FB6.2 R34.1 R35.1
+5DAC: FB4.2
GND: C51.2 C52.1 C55.2 C56.2 C57.2 C58.2 C59.2 C60.2 C61.2 C64.2 C65.2 C66.2 C69.2 C75.2 C189.2 C190.2 C205.2 C206.2 J1.1(sleeve) J3.1 R29.2 R36.1 R61.1 R62.1 U7.2(PGND) U7.9(MODE) U7.11(GND) U7.15(PGND) U8.11(HPGND) U8.15(AGND) U8.22(CSB) U8.28(DGND)
AUDIO_I2S_CLOCK: U8.25(XTI/MCLK) ; port AUDIO_I2S_CLOCK
LHP_OUT: J3.4 R28.1
MIC: C73.2 C75.1 J1.5(ring) R31.2 R61.2 ; port MIC
RHP_OUT: J3.3 R27.1
WM8731_ADC_SD: U8.6(ADCDAT) ; port WM8731_ADC_SD
WM8731_BCLK: U8.3(BCLK) ; port WM8731_BCLK
WM8731_DAC_SD: U8.4(DACDAT) ; port WM8731_DAC_SD
WM8731_SCK: R34.2 U8.24(SCLK) ; port WM8731_SCK
WM8731_SDA: R35.2 U8.23(SDIN) ; port WM8731_SDA
WM8731_WS_LRC: U8.5(DACLRC) U8.7(ADCLRC) ; port WM8731_WS_LRC
NetC51_1: C51.1 C53.1 R28.2
NetC52_2: C52.2 C54.1 R27.2
NetC53_2: C53.2 U7.7(INL)
NetC54_2: C54.2 U7.10(INR)
NetC55_1: C55.1 U7.8(VREF)
NetC56_1: C56.1 C57.1 C58.1 C59.1 FB4.1 U7.4(PVDDL) U7.6(VDD) U7.12(SHDN) U7.13(PVDDR)
NetC60_1: C60.1 C61.1 C64.1 C65.1 C66.1 C205.1 FB5.1 U8.1(DBVDD) U8.8(HPVDD) U8.14(AVDD)
NetC69_1: C69.1 C206.1 FB6.1 U8.27(DCVDD)
NetC71_1: C71.1 U8.9(LHPOUT)
NetC71_2: C71.2 J3.5 R62.2
NetC73_1: C73.1 R30.2
NetC74_1: C74.1 U8.10(RHPOUT)
NetC74_2: C74.2 J3.2 R36.2
NetC189_1: C189.1 C190.1 U8.16(VMID)
NetR29_1: R29.1 U8.21(MODE)
NetR30_1: R30.1 U8.18(MICIN)
NetR31_1: R31.1 U8.17(MICBIAS)
NetU1_64: U7.5(MUTE) ; port MUTE
NetU7_1: U7.1(+OUT) X4.2
NetU7_3: U7.3(WP_(IO2)) X4.1
NetU7_14: U7.14(L-OUR_R) X4.3
NetU7_16: U7.16(L+OUT_R) X4.4

Not connected (* = marked no-connect by the designer): J1 2(tip); U8 2(CLKOUT)* 12(LOUT)* 13(ROUT)* 19(RLINEIN)* 20(LLINEIN)* 26(XTO)*

### Notes on the sheet
- "LOUT"
- "ROUT"
- Перв. примен.
- Справ. №
- Подп. и дата
- Инв. № дубл.
- Взам. инв. №
- Инв. № подл.
- Изм.
- Лист
- № докум.
- Подп.
- Дата
- 2.106-A2
- Копировал
- Формат А2
- (in symbol 4-Connector) Конт.; Цепь

### Library data of the parts
C51-C55 C57-C59 C61 C66 C69 C75 C190 C205 = Capacitor: Manufacturer: *; Model: *; HelpURL: *; ComponentKind: *; Value: *
C56 C60 C64 C65 C71 C73 C74 C189 C206 = TantalCap: Manufacturer: *; Model: *; HelpURL: *; ComponentKind: *; Value: *
FB4-FB6 = FB
J1 = SJ1-3523N
J3 = PJ-3,5
R27-R31 R34-R36 R61 R62 = Resistor: Manufacturer: *; Model: *; HelpURL: *; ComponentKind: *; Value: *
X4 = 4-Connector: Model: *; Manufacturer: *; HelpURL: *; ComponentKind: *

## Sheet WL-CONTROL.SchDoc
size 420 x 297 mm; Address1: Address1; Address2: Address2; Address3: Address3; Address4: Address4; DocumentNumber: Wolf-Lite; SheetNumber: 9; Scale: 1:1; DocumentType: Схема электрическая принципиальная; FirstReferrence: UA3REO/R7KBI
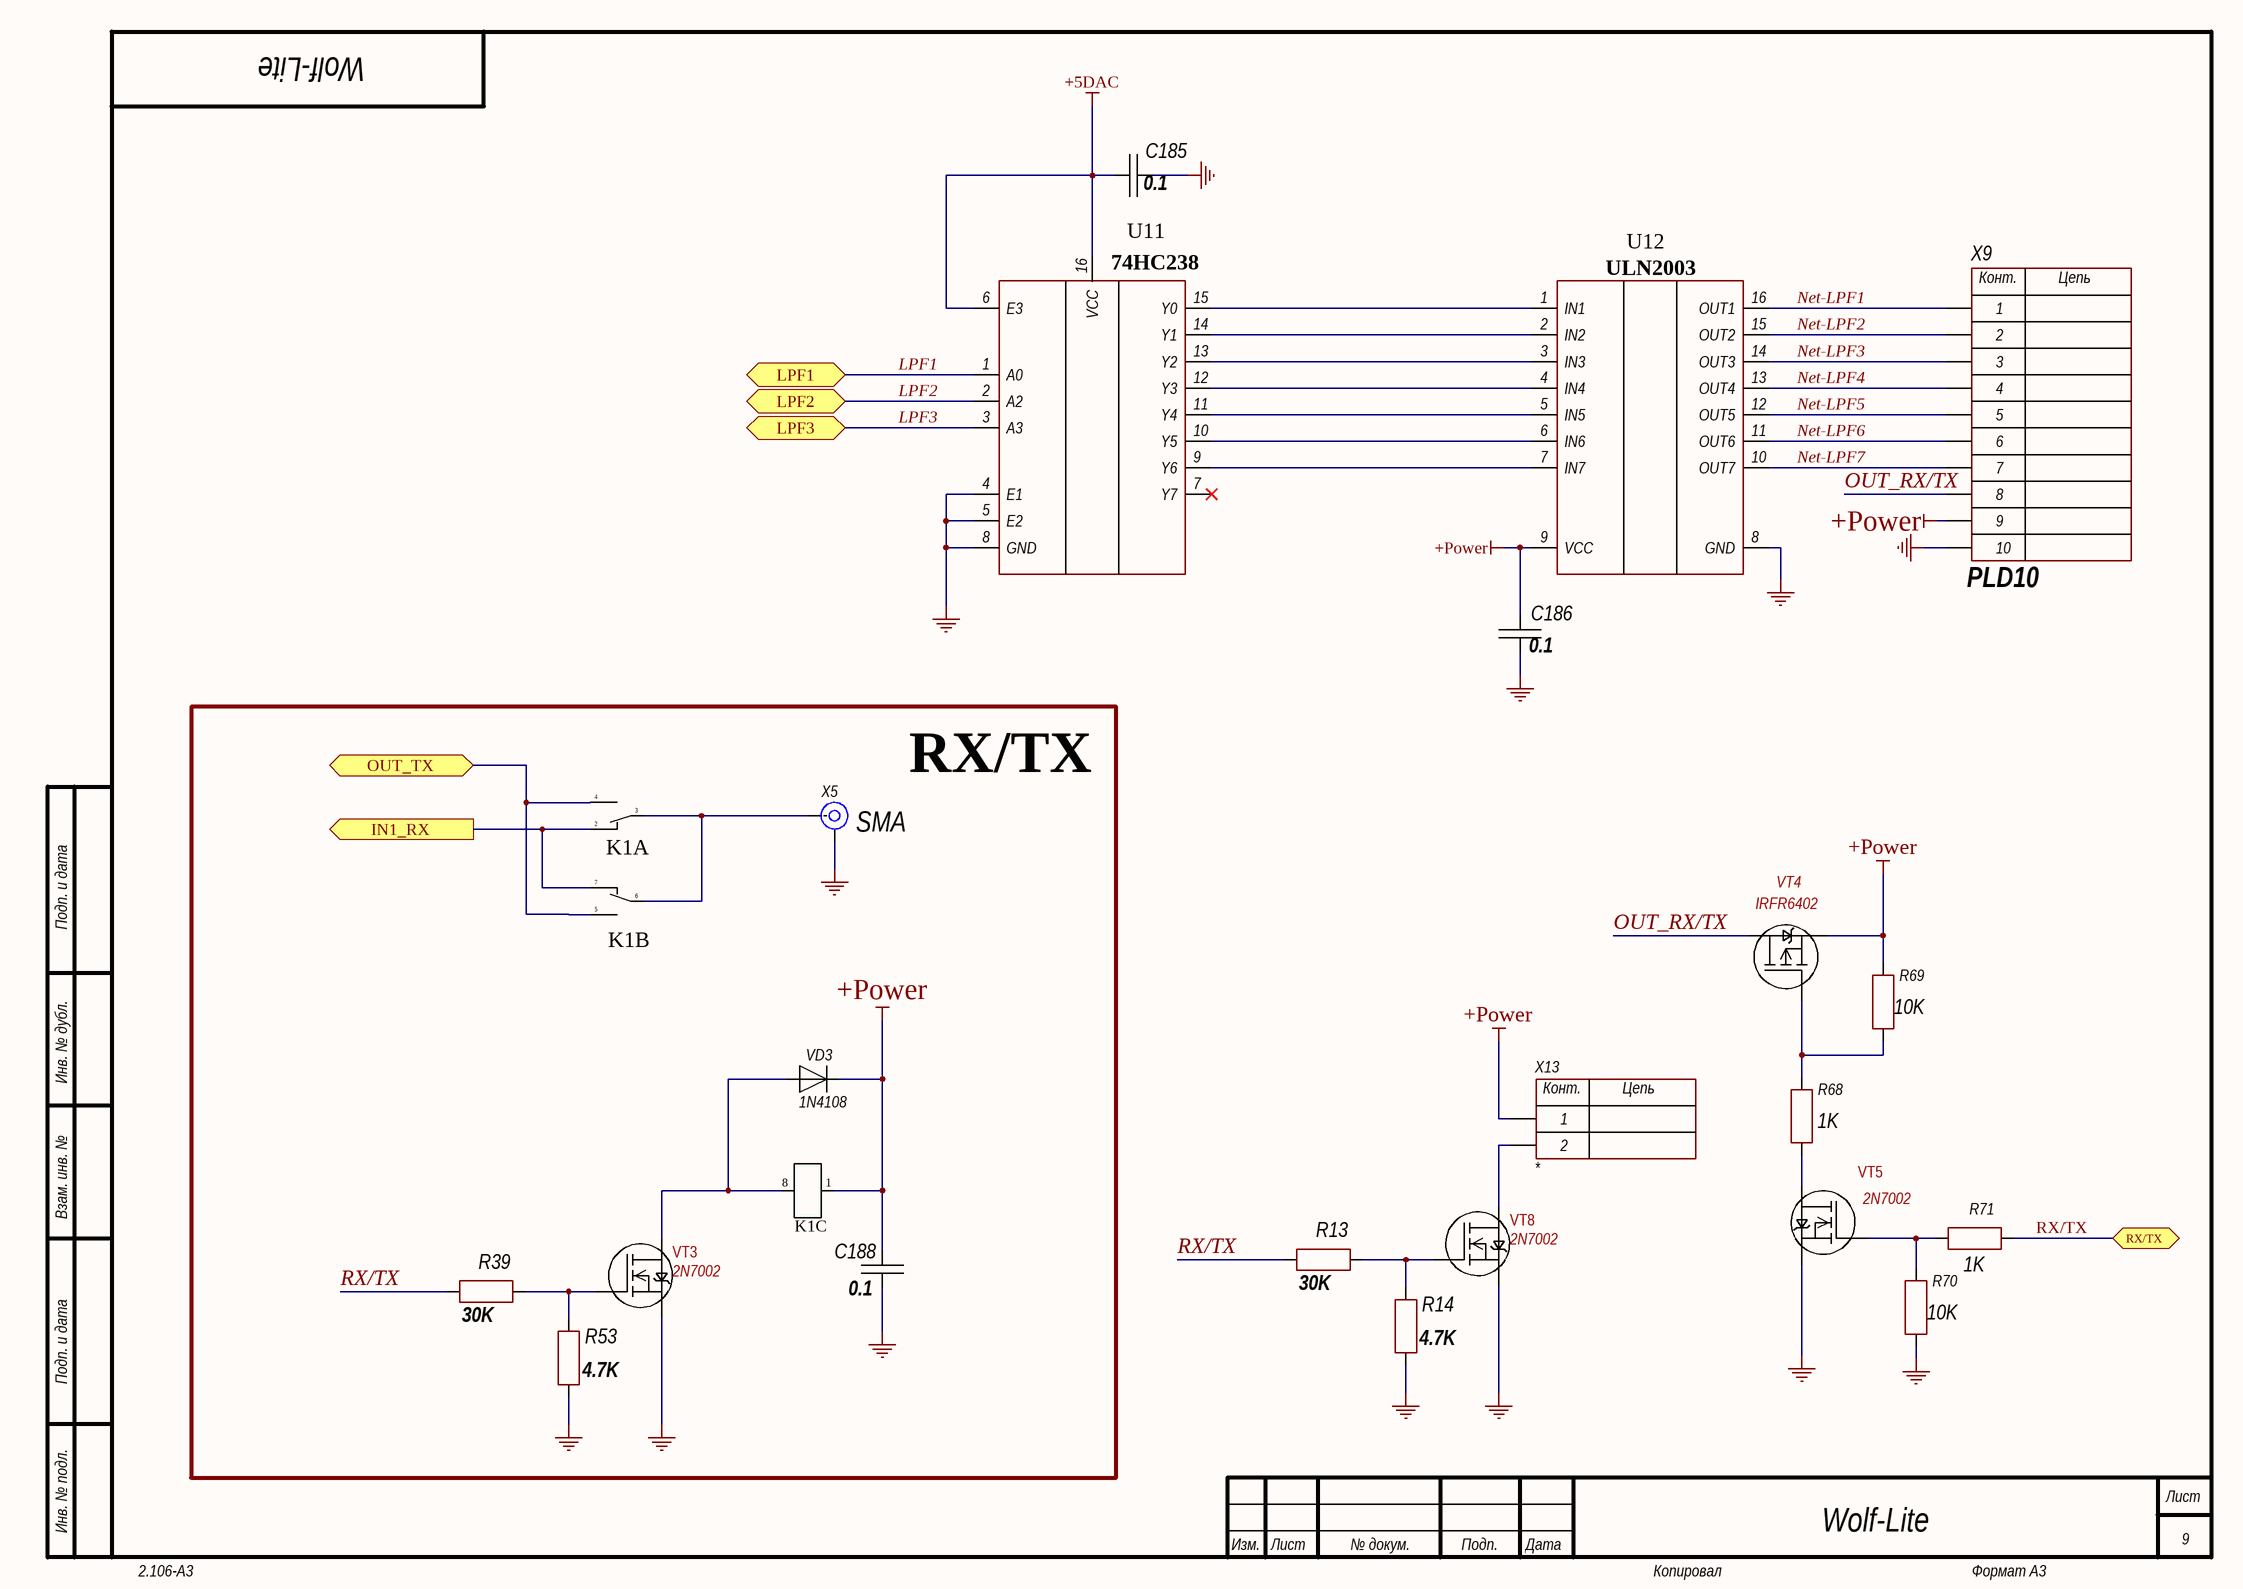
[diagram p8: WL-CONTROL.SchDoc]

### Parts
C185  0.1  [CH0805C]
C186  0.1  [CH0805C]
C188  0.1  [CH0805C]
K1  IM06  [IMG06]  (value not drawn)  (parts A,B,C of 3)
R13  30K  [CH0805R]
R14  4.7K  [CH0805R]
R39  30K  [CH0805R]
R53  4.7K  [CH0805R]
R68  1K  [CH0805R]
R69  10K  [CH0805R]
R70  10K  [CH0805R]
R71  1K  [CH0805R]
U11  74HC238  [16-SOIC]
U12  ULN2003  [16-SOIC]
VD3  1N4108  [1N4148]
VT3  2N7002  [SOT23_132]
VT4  IRFR6402  [SOT23_132]
VT5  2N7002  [SOT23_132]
VT8  2N7002  [SOT23_132]
X5  SMA  [CON: SMA]
X9  PLD10  [CON: PLD-10]
X13  *  [CON: PLS-2]

### Blocks framed on the sheet
RX/TX: C188 K1 R39 R53 VD3 VT3 X5

### Ports
IN1_RX (out), LPF1 (bidir), LPF2 (bidir), LPF3 (bidir), OUT_TX (bidir), RX/TX (bidir)

### Nets
+5DAC: C185.1 U11.6(E3) U11.16(VCC)
+Power: C186.2 C188.1 K1.1 R69.2 U12.9(VCC) VD3.2 VT4.2(I) X9.9 X13.1  [project net POWER-ON]
GND: C185.2 C186.1 C188.2 R14.1 R53.1 R70.1 U11.4(E1) U11.5(E2) U11.8(GND) U12.8(GND) VT3.2(I) VT5.2(I) VT8.2(I) X5.2(IN) X9.10
LPF1: U11.1(A0) ; port LPF1
LPF2: U11.2(A2) ; port LPF2
LPF3: U11.3(A3) ; port LPF3
Net-LPF1: U12.16(OUT1) X9.1
Net-LPF2: U12.15(OUT2) X9.2
Net-LPF3: U12.14(OUT3) X9.3
Net-LPF4: U12.13(OUT4) X9.4
Net-LPF5: U12.12(OUT5) X9.5
Net-LPF6: U12.11(OUT6) X9.6
Net-LPF7: U12.10(OUT7) X9.7
OUT_RX/TX: VT4.3(Сток(Drain)) X9.8
RX/TX: R13.2 R39.2 R71.1 ; port RX/TX
NetC76_1: K1.2 K1.7 ; port IN1_RX
NetK1_3: K1.3 K1.6 X5.1(IN)
NetK1_4: K1.4 K1.5 ; port OUT_TX
NetK1_8: K1.8 VD3.1 VT3.3(Сток(Drain))
NetR13_1: R13.1 R14.2 VT8.1(Затвор(Gate))
NetR39_1: R39.1 R53.2 VT3.1(Затвор(Gate))
NetR68_1: R68.1 VT5.3(Сток(Drain))
NetR68_2: R68.2 R69.1 VT4.1(Затвор(Gate))
NetR70_2: R70.2 R71.2 VT5.1(Затвор(Gate))
NetU11_9: U11.9(Y6) U12.7(IN7)
NetU11_10: U11.10(Y5) U12.6(IN6)
NetU11_11: U11.11(Y4) U12.5(IN5)
NetU11_12: U11.12(Y3) U12.4(IN4)
NetU11_13: U11.13(Y2) U12.3(IN3)
NetU11_14: U11.14(Y1) U12.2(IN2)
NetU11_15: U11.15(Y0) U12.1(IN1)
NetVT8_3: VT8.3(Сток(Drain)) X13.2

Not connected (* = marked no-connect by the designer): U11 7(Y7)*

### Notes on the sheet
- Подп. и дата
- Инв. № дубл.
- Взам. инв. №
- Инв. № подл.
- Изм.
- Лист
- № докум.
- Подп.
- Дата
- 2.106-A3
- Копировал
- Формат А3
- (in symbol 2-Connector) Конт.; Цепь
- (in symbol 10-Connector) Конт.; Цепь

### Library data of the parts
C185 C186 C188 = Capacitor: Manufacturer: *; Model: *; HelpURL: *; ComponentKind: *; Value: *
K1 = IM06-1
R13 R14 R39 R53 R68-R71 = Resistor: Manufacturer: *; Model: *; HelpURL: *; ComponentKind: *; Value: *
U12 = ULN2003_NEW
VD3 = Diod: ComponentKind: *; Manufacturer: *; Model: *; HelpURL: *
VT3 VT5 VT8 = N-KANAL
VT4 = P-KANAL
X5 = SMA: RF; Model: *; Manufacturer: *; HelpURL: *; ComponentKind: *
X9 = 10-Connector: Model: *; Manufacturer: *; HelpURL: *; ComponentKind: *
X13 = 2-Connector: Model: *; Manufacturer: *; HelpURL: *; ComponentKind: *

## Sheet WL-BPF.SchDoc
size 594 x 420 mm; Address1: Address1; Address2: Address2; Address3: Address3; Address4: Address4; DocumentNumber: Wolf-Lite; SheetNumber: 10; Scale: 1:1; DocumentType: Схема электрическая принципиальная; FirstReferrence: UA3REO/R7KBI; ListNumber: 2
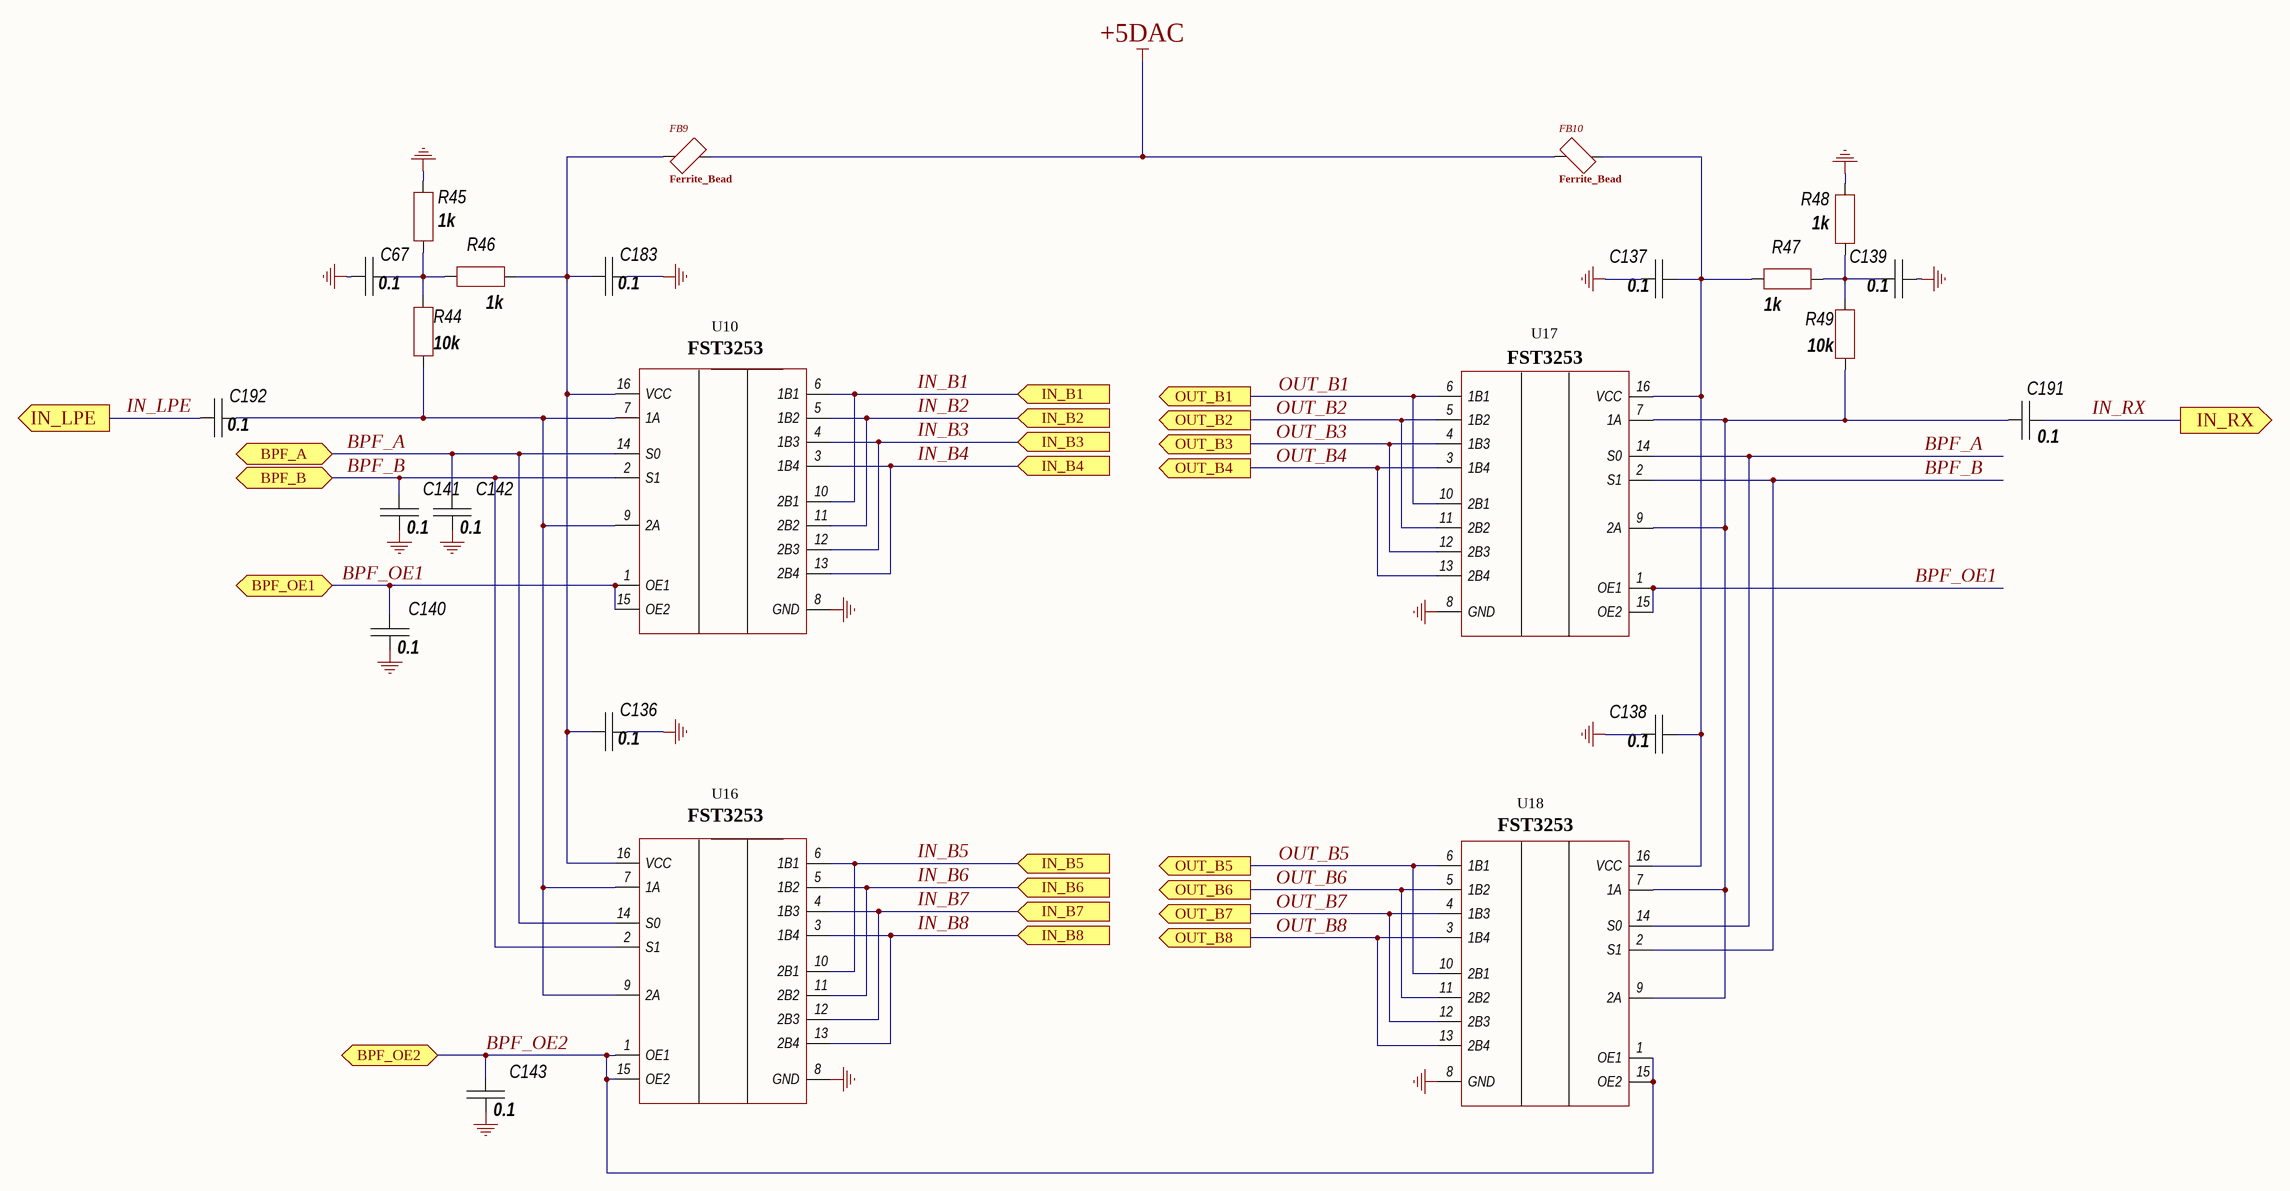
[diagram p9: WL-BPF.SchDoc]

### Parts
C67  0.1  [CH0805C]
C136  0.1  [CH0805C]
C137  0.1  [CH0805C]
C138  0.1  [CH0805C]
C139  0.1  [CH0805C]
C140  0.1  [CH0805C]
C141  0.1  [CH0805C]
C142  0.1  [CH0805C]
C143  0.1  [CH0805C]
C183  0.1  [CH0805C]
C191  0.1  [CH0805C]
C192  0.1  [CH0805C]
FB9  Ferrite_Bead  [CH0805L]
FB10  Ferrite_Bead  [CH0805L]
R44  10k  [CH0805R]
R45  1k  [CH0805R]
R46  1k  [CH0805R]
R47  1k  [CH0805R]
R48  1k  [CH0805R]
R49  10k  [CH0805R]
U10  FST3253  [16-SSOP]
U16  FST3253  [16-SSOP]
U17  FST3253  [16-SSOP]
U18  FST3253  [16-SSOP]

### Ports
BPF_A (bidir), BPF_B (bidir), BPF_OE1 (bidir), BPF_OE2 (bidir), IN_B1 (in), IN_B2 (in), IN_B3 (in), IN_B4 (in), IN_B5 (in), IN_B6 (in), IN_B7 (in), IN_B8 (in), IN_LPE (out), IN_RX (out), OUT_B1 (out), OUT_B2 (out), OUT_B3 (out), OUT_B4 (out), OUT_B5 (out), OUT_B6 (out), OUT_B7 (out), OUT_B8 (out)

### Nets
+5DAC: FB9.2 FB10.2
GND: C67.1 C136.2 C137.2 C138.2 C139.1 C140.2 C141.2 C142.2 C143.2 C183.2 R45.1 R48.1 U10.8(GND) U16.8(GND) U17.8(GND) U18.8(GND)
BPF_A: C142.1 U10.14(S0) U16.14(S0) U17.14(S0) U18.14(S0) ; port BPF_A
BPF_B: C141.1 U10.2(S1) U16.2(S1) U17.2(S1) U18.2(S1) ; port BPF_B
BPF_OE1: C140.1 U10.1(OE1) U10.15(OE2) U17.1(OE1) U17.15(OE2) ; port BPF_OE1
BPF_OE2: C143.1 U16.1(OE1) U16.15(OE2) U18.1(OE1) U18.15(OE2) ; port BPF_OE2
IN_B1: U10.6(1B1) U10.10(2B1) ; port IN_B1
IN_B2: U10.5(1B2) U10.11(2B2) ; port IN_B2
IN_B3: U10.4(1B3) U10.12(2B3) ; port IN_B3
IN_B4: U10.3(1B4) U10.13(2B4) ; port IN_B4
IN_B5: U16.6(1B1) U16.10(2B1) ; port IN_B5
IN_B6: U16.5(1B2) U16.11(2B2) ; port IN_B6
IN_B7: U16.4(1B3) U16.12(2B3) ; port IN_B7
IN_B8: U16.3(1B4) U16.13(2B4) ; port IN_B8
IN_LPE: C192.1 ; port IN_LPE
IN_RX: C191.1 ; port IN_RX
OUT_B1: U17.6(1B1) U17.10(2B1) ; port OUT_B1
OUT_B2: U17.5(1B2) U17.11(2B2) ; port OUT_B2
OUT_B3: U17.4(1B3) U17.12(2B3) ; port OUT_B3
OUT_B4: U17.3(1B4) U17.13(2B4) ; port OUT_B4
OUT_B5: U18.6(1B1) U18.10(2B1) ; port OUT_B5
OUT_B6: U18.5(1B2) U18.11(2B2) ; port OUT_B6
OUT_B7: U18.4(1B3) U18.12(2B3) ; port OUT_B7
OUT_B8: U18.3(1B4) U18.13(2B4) ; port OUT_B8
NetC67_2: C67.2 R44.2 R45.2 R46.2
NetC136_1: C136.1 C183.1 FB9.1 R46.1 U10.16(VCC) U16.16(VCC)
NetC137_1: C137.1 C138.1 FB10.1 R47.1 U17.16(VCC) U18.16(VCC)
NetC139_2: C139.2 R47.2 R48.2 R49.2
NetC191_2: C191.2 R49.1 U17.7(1A) U17.9(2A) U18.7(1A) U18.9(2A)
NetC192_2: C192.2 R44.1 U10.7(1A) U10.9(2A) U16.7(1A) U16.9(2A)

### Notes on the sheet
- Перв. примен.
- Справ. №
- Подп. и дата
- Инв. № дубл.
- Взам. инв. №
- Инв. № подл.
- Изм.
- Лист
- № докум.
- Подп.
- Дата
- 2.106-A2
- Копировал
- Формат А2

### Library data of the parts
C67 C136-C143 C183 C191 C192 = Capacitor: Manufacturer: *; Model: *; HelpURL: *; ComponentKind: *; Value: *
FB9 FB10 = FB
R44-R49 = Resistor: Manufacturer: *; Model: *; HelpURL: *; ComponentKind: *; Value: *